# EAGLE design Mem Register V1.0 (EAGLE 9.6.2)

## Sheet 1 of 3: BUS
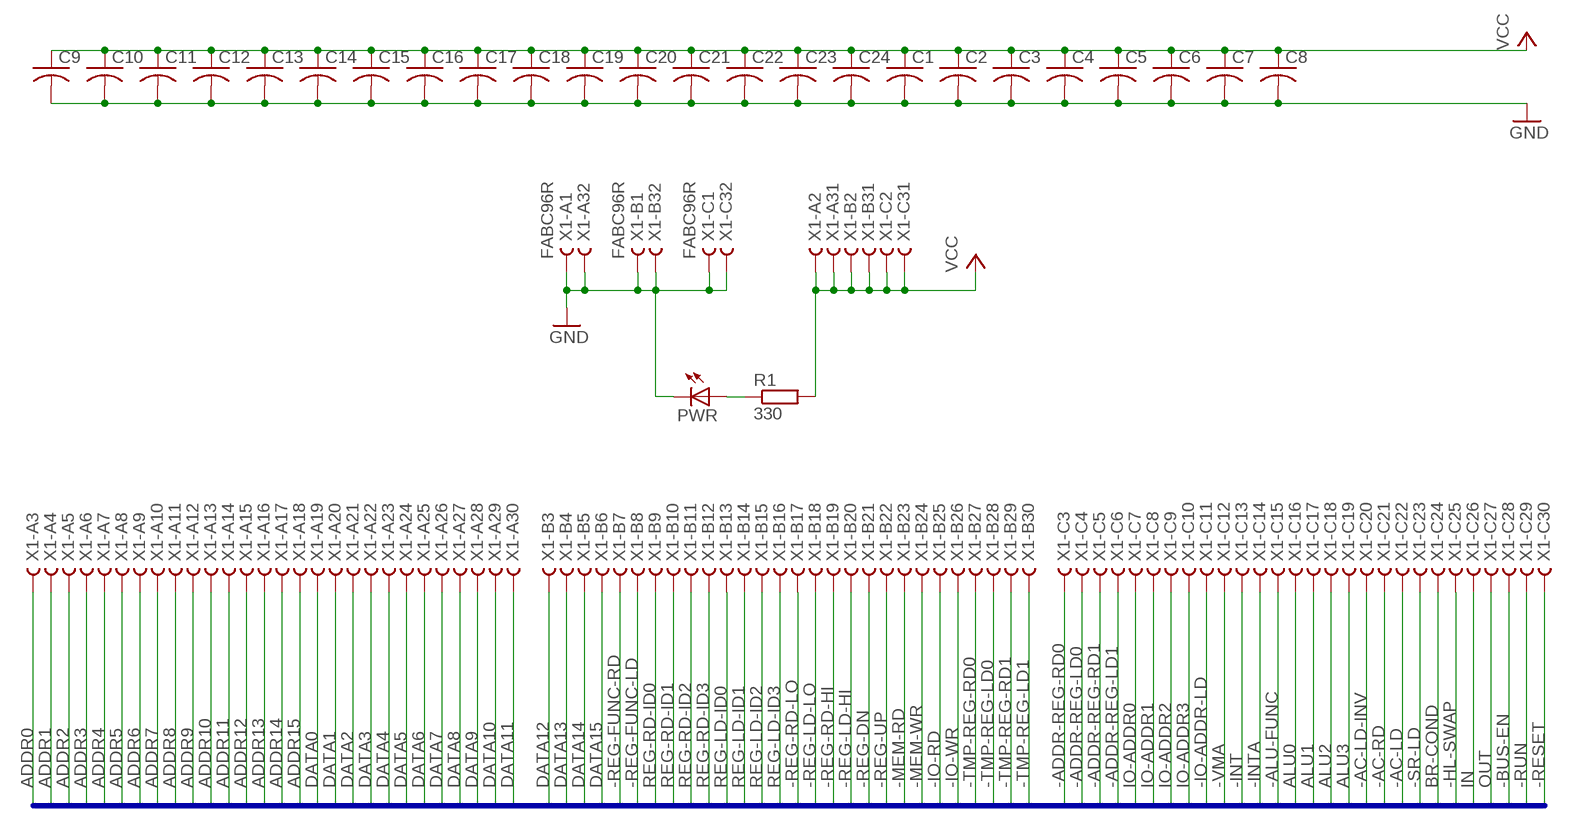
[diagram p0: schematic, sheet 1]

### Parts
C1  C-US025-025X050  [C025-025X050]
C2  C-US025-025X050  [C025-025X050]
C3  C-US025-025X050  [C025-025X050]
C4  C-US025-025X050  [C025-025X050]
C5  C-US025-025X050  [C025-025X050]
C6  C-US025-025X050  [C025-025X050]
C7  C-US025-025X050  [C025-025X050]
C8  C-US025-025X050  [C025-025X050]
C9  C-US025-025X050  [C025-025X050]
C10  C-US025-025X050  [C025-025X050]
C11  C-US025-025X050  [C025-025X050]
C12  C-US025-025X050  [C025-025X050]
C13  C-US025-025X050  [C025-025X050]
C14  C-US025-025X050  [C025-025X050]
C15  C-US025-025X050  [C025-025X050]
C16  C-US025-025X050  [C025-025X050]
C17  C-US025-025X050  [C025-025X050]
C18  C-US025-025X050  [C025-025X050]
C19  C-US025-025X050  [C025-025X050]
C20  C-US025-025X050  [C025-025X050]
C21  C-US025-025X050  [C025-025X050]
C22  C-US025-025X050  [C025-025X050]
C23  C-US025-025X050  [C025-025X050]
C24  C-US025-025X050  [C025-025X050]
PWR  LED5MM  [LED5MM]
R1  330  R0207/10  [0207/10]
X1  FABC96R  [FABC96R]

### Nets
-AC-LD: X1.C22
-AC-LD-INV: X1.C20
-AC-RD: X1.C21
-ADDR-REG-LD0: X1.C4
-ADDR-REG-LD1: X1.C6
-ADDR-REG-RD0: X1.C3
-ADDR-REG-RD1: X1.C5
-ALU-FUNC: X1.C15
-BUS-EN: X1.C28 ; also sheet 3
-HL-SWAP: X1.C25
-INT: X1.C13
-INTA: X1.C14
-IO-ADDR-LD: X1.C11
-IO-RD: X1.B25
-IO-WR: X1.B26
-MEM-RD: X1.B23 ; also sheet 3
-MEM-WR: X1.B24 ; also sheet 3
-REG-DN: X1.B21
-REG-FUNC-LD: X1.B8
-REG-FUNC-RD: X1.B7
-REG-LD-HI: X1.B20
-REG-LD-LO: X1.B18
-REG-RD-HI: X1.B19
-REG-RD-LO: X1.B17
-REG-UP: X1.B22
-RESET: X1.C30
-RUN: X1.C29
-SR-LD: X1.C23
-TMP-REG-LD0: X1.B28
-TMP-REG-LD1: X1.B30
-TMP-REG-RD0: X1.B27
-TMP-REG-RD1: X1.B29
-VMA: X1.C12 ; also sheet 3
ADDR0: X1.A3 ; also sheet 3
ADDR1: X1.A4 ; also sheet 3
ADDR2: X1.A5 ; also sheet 3
ADDR3: X1.A6 ; also sheet 3
ADDR4: X1.A7 ; also sheet 3
ADDR5: X1.A8 ; also sheet 3
ADDR6: X1.A9 ; also sheet 3
ADDR7: X1.A10 ; also sheet 3
ADDR8: X1.A11 ; also sheet 3
ADDR9: X1.A12 ; also sheet 3
ADDR10: X1.A13 ; also sheet 3
ADDR11: X1.A14 ; also sheet 3
ADDR12: X1.A15 ; also sheet 3
ADDR13: X1.A16 ; also sheet 3
ADDR14: X1.A17 ; also sheet 3
ADDR15: X1.A18 ; also sheet 3
ALU0: X1.C16
ALU1: X1.C17
ALU2: X1.C18
ALU3: X1.C19
BR-COND: X1.C24
DATA0: X1.A19 ; also sheet 2
DATA1: X1.A20 ; also sheet 2
DATA2: X1.A21 ; also sheet 2
DATA3: X1.A22 ; also sheet 2
DATA4: X1.A23 ; also sheet 2
DATA5: X1.A24 ; also sheet 2
DATA6: X1.A25 ; also sheet 2
DATA7: X1.A26 ; also sheet 2
DATA8: X1.A27
DATA9: X1.A28
DATA10: X1.A29
DATA11: X1.A30
DATA12: X1.B3
DATA13: X1.B4
DATA14: X1.B5
DATA15: X1.B6
GND: C1.2 C2.2 C3.2 C4.2 C5.2 C6.2 C7.2 C8.2 C9.2 C10.2 C11.2 C12.2 C13.2 C14.2 C15.2 C16.2 C17.2 C18.2 C19.2 C20.2 C21.2 C22.2 C23.2 C24.2 PWR.K(C) X1.A1 X1.A32 X1.B1 X1.B32 X1.C1 X1.C32 ; also sheet 3
IN: X1.C26
IO-ADDR0: X1.C7
IO-ADDR1: X1.C8
IO-ADDR2: X1.C9
IO-ADDR3: X1.C10
N$11: PWR.A R1.1
OUT: X1.C27
REG-LD-ID0: X1.B13
REG-LD-ID1: X1.B14
REG-LD-ID2: X1.B15
REG-LD-ID3: X1.B16
REG-RD-ID0: X1.B9
REG-RD-ID1: X1.B10
REG-RD-ID2: X1.B11
REG-RD-ID3: X1.B12
VCC: C1.1 C2.1 C3.1 C4.1 C5.1 C6.1 C7.1 C8.1 C9.1 C10.1 C11.1 C12.1 C13.1 C14.1 C15.1 C16.1 C17.1 C18.1 C19.1 C20.1 C21.1 C22.1 C23.1 C24.1 R1.2 X1.A2 X1.A31 X1.B2 X1.B31 X1.C2 X1.C31 ; also sheet 3

### Buses
-AC-LD,-AC-LD-INV,-AC-RD,ADDR[0..15],-ADDR-REG-LD[0..1],-ADDR-REG-RD[0..1],ALU[0..3],-ALU-FUNC,BR-COND,-BUS-EN,DATA[0..15],-HL-SWAP,IN,-INT,-INTA,IO-ADDR[0..3],-IO-ADDR-LD,-IO-RD,-IO-WR,-MEM-RD,-MEM-WR,OUT,-REG-DN,-REG-FUNC-LD,-REG-FUNC-RD,-REG-LD-HI,REG-LD-ID[0..3],-REG-LD-LO,-REG-RD-HI,REG-RD-ID[0..3],-REG-RD-LO,-REG-UP,-RESET,-RUN,-SR-LD,-TMP-REG-LD[0..1],-TMP-REG-RD[0..1],-VMA

## Sheet 2 of 3
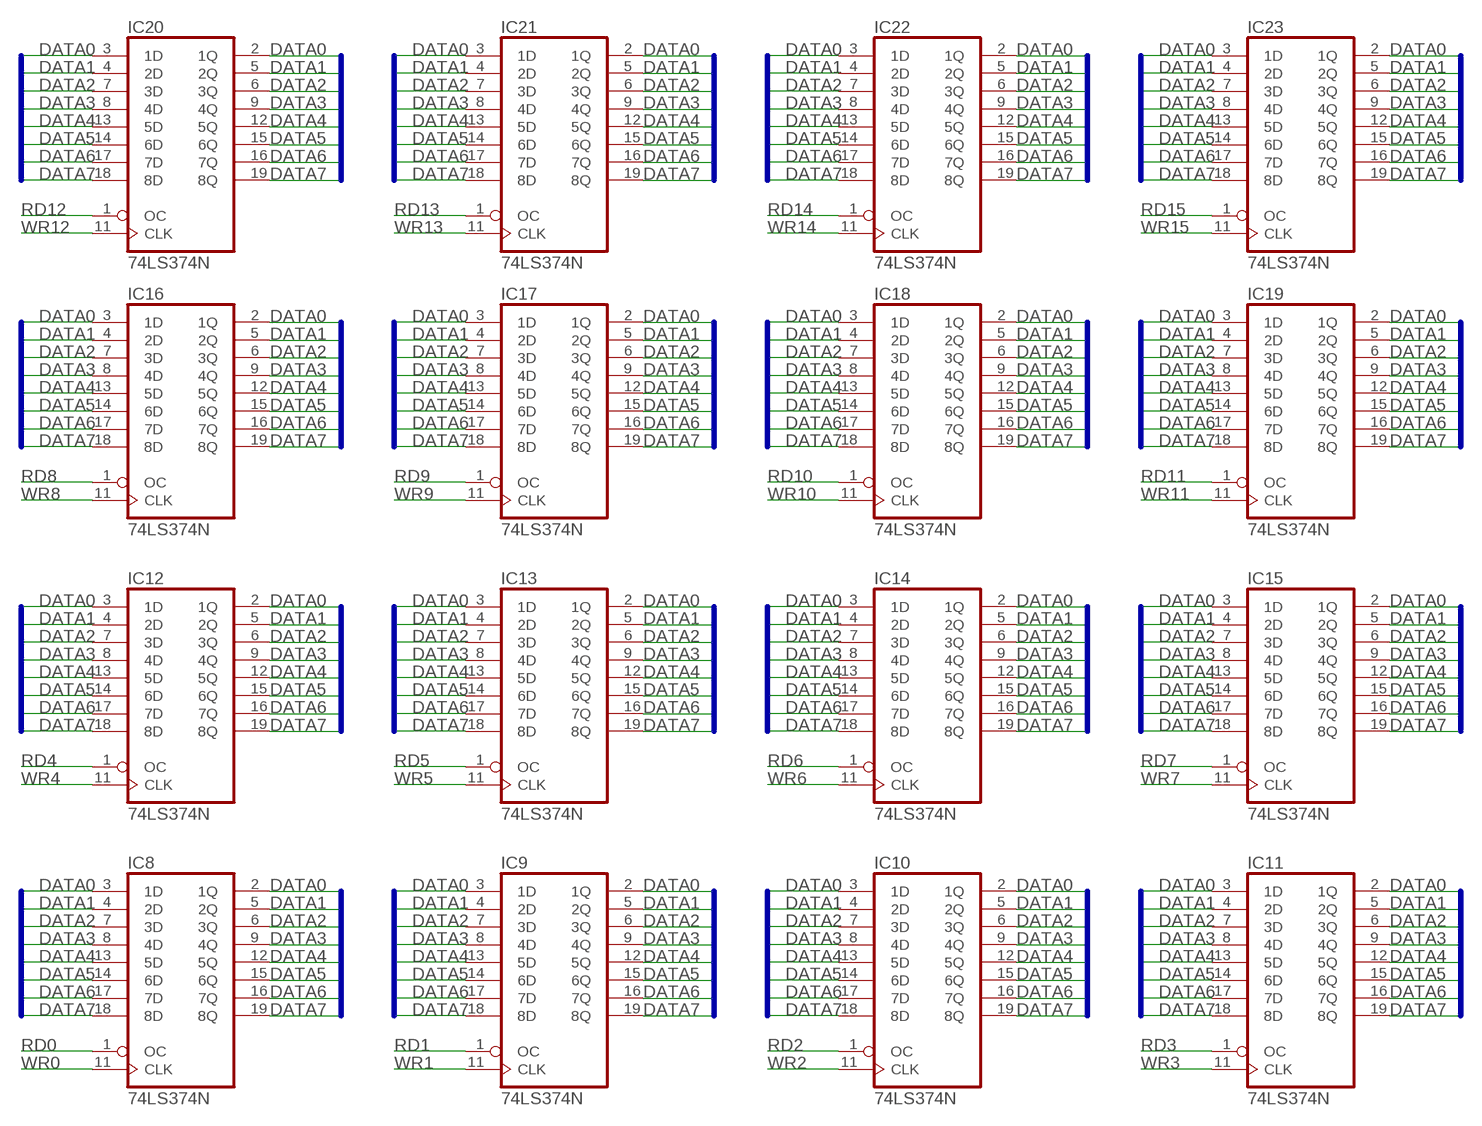
[diagram p1: schematic, sheet 2]

### Parts
IC8  74LS374N  [DIL20]
IC9  74LS374N  [DIL20]
IC10  74LS374N  [DIL20]
IC11  74LS374N  [DIL20]
IC12  74LS374N  [DIL20]
IC13  74LS374N  [DIL20]
IC14  74LS374N  [DIL20]
IC15  74LS374N  [DIL20]
IC16  74LS374N  [DIL20]
IC17  74LS374N  [DIL20]
IC18  74LS374N  [DIL20]
IC19  74LS374N  [DIL20]
IC20  74LS374N  [DIL20]
IC21  74LS374N  [DIL20]
IC22  74LS374N  [DIL20]
IC23  74LS374N  [DIL20]

### Nets
DATA0: IC8.2(1Q) IC8.3(1D) IC9.2(1Q) IC9.3(1D) IC10.2(1Q) IC10.3(1D) IC11.2(1Q) IC11.3(1D) IC12.2(1Q) IC12.3(1D) IC13.2(1Q) IC13.3(1D) IC14.2(1Q) IC14.3(1D) IC15.2(1Q) IC15.3(1D) IC16.2(1Q) IC16.3(1D) IC17.2(1Q) IC17.3(1D) IC18.2(1Q) IC18.3(1D) IC19.2(1Q) IC19.3(1D) IC20.2(1Q) IC20.3(1D) IC21.2(1Q) IC21.3(1D) IC22.2(1Q) IC22.3(1D) IC23.2(1Q) IC23.3(1D) ; also sheet 1
DATA1: IC8.4(2D) IC8.5(2Q) IC9.4(2D) IC9.5(2Q) IC10.4(2D) IC10.5(2Q) IC11.4(2D) IC11.5(2Q) IC12.4(2D) IC12.5(2Q) IC13.4(2D) IC13.5(2Q) IC14.4(2D) IC14.5(2Q) IC15.4(2D) IC15.5(2Q) IC16.4(2D) IC16.5(2Q) IC17.4(2D) IC17.5(2Q) IC18.4(2D) IC18.5(2Q) IC19.4(2D) IC19.5(2Q) IC20.4(2D) IC20.5(2Q) IC21.4(2D) IC21.5(2Q) IC22.4(2D) IC22.5(2Q) IC23.4(2D) IC23.5(2Q) ; also sheet 1
DATA2: IC8.6(3Q) IC8.7(3D) IC9.6(3Q) IC9.7(3D) IC10.6(3Q) IC10.7(3D) IC11.6(3Q) IC11.7(3D) IC12.6(3Q) IC12.7(3D) IC13.6(3Q) IC13.7(3D) IC14.6(3Q) IC14.7(3D) IC15.6(3Q) IC15.7(3D) IC16.6(3Q) IC16.7(3D) IC17.6(3Q) IC17.7(3D) IC18.6(3Q) IC18.7(3D) IC19.6(3Q) IC19.7(3D) IC20.6(3Q) IC20.7(3D) IC21.6(3Q) IC21.7(3D) IC22.6(3Q) IC22.7(3D) IC23.6(3Q) IC23.7(3D) ; also sheet 1
DATA3: IC8.8(4D) IC8.9(4Q) IC9.8(4D) IC9.9(4Q) IC10.8(4D) IC10.9(4Q) IC11.8(4D) IC11.9(4Q) IC12.8(4D) IC12.9(4Q) IC13.8(4D) IC13.9(4Q) IC14.8(4D) IC14.9(4Q) IC15.8(4D) IC15.9(4Q) IC16.8(4D) IC16.9(4Q) IC17.8(4D) IC17.9(4Q) IC18.8(4D) IC18.9(4Q) IC19.8(4D) IC19.9(4Q) IC20.8(4D) IC20.9(4Q) IC21.8(4D) IC21.9(4Q) IC22.8(4D) IC22.9(4Q) IC23.8(4D) IC23.9(4Q) ; also sheet 1
DATA4: IC8.12(5Q) IC8.13(5D) IC9.12(5Q) IC9.13(5D) IC10.12(5Q) IC10.13(5D) IC11.12(5Q) IC11.13(5D) IC12.12(5Q) IC12.13(5D) IC13.12(5Q) IC13.13(5D) IC14.12(5Q) IC14.13(5D) IC15.12(5Q) IC15.13(5D) IC16.12(5Q) IC16.13(5D) IC17.12(5Q) IC17.13(5D) IC18.12(5Q) IC18.13(5D) IC19.12(5Q) IC19.13(5D) IC20.12(5Q) IC20.13(5D) IC21.12(5Q) IC21.13(5D) IC22.12(5Q) IC22.13(5D) IC23.12(5Q) IC23.13(5D) ; also sheet 1
DATA5: IC8.14(6D) IC8.15(6Q) IC9.14(6D) IC9.15(6Q) IC10.14(6D) IC10.15(6Q) IC11.14(6D) IC11.15(6Q) IC12.14(6D) IC12.15(6Q) IC13.14(6D) IC13.15(6Q) IC14.14(6D) IC14.15(6Q) IC15.14(6D) IC15.15(6Q) IC16.14(6D) IC16.15(6Q) IC17.14(6D) IC17.15(6Q) IC18.14(6D) IC18.15(6Q) IC19.14(6D) IC19.15(6Q) IC20.14(6D) IC20.15(6Q) IC21.14(6D) IC21.15(6Q) IC22.14(6D) IC22.15(6Q) IC23.14(6D) IC23.15(6Q) ; also sheet 1
DATA6: IC8.16(7Q) IC8.17(7D) IC9.16(7Q) IC9.17(7D) IC10.16(7Q) IC10.17(7D) IC11.16(7Q) IC11.17(7D) IC12.16(7Q) IC12.17(7D) IC13.16(7Q) IC13.17(7D) IC14.16(7Q) IC14.17(7D) IC15.16(7Q) IC15.17(7D) IC16.16(7Q) IC16.17(7D) IC17.16(7Q) IC17.17(7D) IC18.16(7Q) IC18.17(7D) IC19.16(7Q) IC19.17(7D) IC20.16(7Q) IC20.17(7D) IC21.16(7Q) IC21.17(7D) IC22.16(7Q) IC22.17(7D) IC23.16(7Q) IC23.17(7D) ; also sheet 1
DATA7: IC8.18(8D) IC8.19(8Q) IC9.18(8D) IC9.19(8Q) IC10.18(8D) IC10.19(8Q) IC11.18(8D) IC11.19(8Q) IC12.18(8D) IC12.19(8Q) IC13.18(8D) IC13.19(8Q) IC14.18(8D) IC14.19(8Q) IC15.18(8D) IC15.19(8Q) IC16.18(8D) IC16.19(8Q) IC17.18(8D) IC17.19(8Q) IC18.18(8D) IC18.19(8Q) IC19.18(8D) IC19.19(8Q) IC20.18(8D) IC20.19(8Q) IC21.18(8D) IC21.19(8Q) IC22.18(8D) IC22.19(8Q) IC23.18(8D) IC23.19(8Q) ; also sheet 1
RD0: IC8.1(OC) ; also sheet 3
RD1: IC9.1(OC) ; also sheet 3
RD2: IC10.1(OC) ; also sheet 3
RD3: IC11.1(OC) ; also sheet 3
RD4: IC12.1(OC) ; also sheet 3
RD5: IC13.1(OC) ; also sheet 3
RD6: IC14.1(OC) ; also sheet 3
RD7: IC15.1(OC) ; also sheet 3
RD8: IC16.1(OC) ; also sheet 3
RD9: IC17.1(OC) ; also sheet 3
RD10: IC18.1(OC) ; also sheet 3
RD11: IC19.1(OC) ; also sheet 3
RD12: IC20.1(OC) ; also sheet 3
RD13: IC21.1(OC) ; also sheet 3
RD14: IC22.1(OC) ; also sheet 3
RD15: IC23.1(OC) ; also sheet 3
WR0: IC8.11(CLK) ; also sheet 3
WR1: IC9.11(CLK) ; also sheet 3
WR2: IC10.11(CLK) ; also sheet 3
WR3: IC11.11(CLK) ; also sheet 3
WR4: IC12.11(CLK) ; also sheet 3
WR5: IC13.11(CLK) ; also sheet 3
WR6: IC14.11(CLK) ; also sheet 3
WR7: IC15.11(CLK) ; also sheet 3
WR8: IC16.11(CLK) ; also sheet 3
WR9: IC17.11(CLK) ; also sheet 3
WR10: IC18.11(CLK) ; also sheet 3
WR11: IC19.11(CLK) ; also sheet 3
WR12: IC20.11(CLK) ; also sheet 3
WR13: IC21.11(CLK) ; also sheet 3
WR14: IC22.11(CLK) ; also sheet 3
WR15: IC23.11(CLK) ; also sheet 3

### Buses
DATA0,DATA1,DATA2,DATA3,DATA4,DATA5,DATA6,DATA7

## Sheet 3 of 3
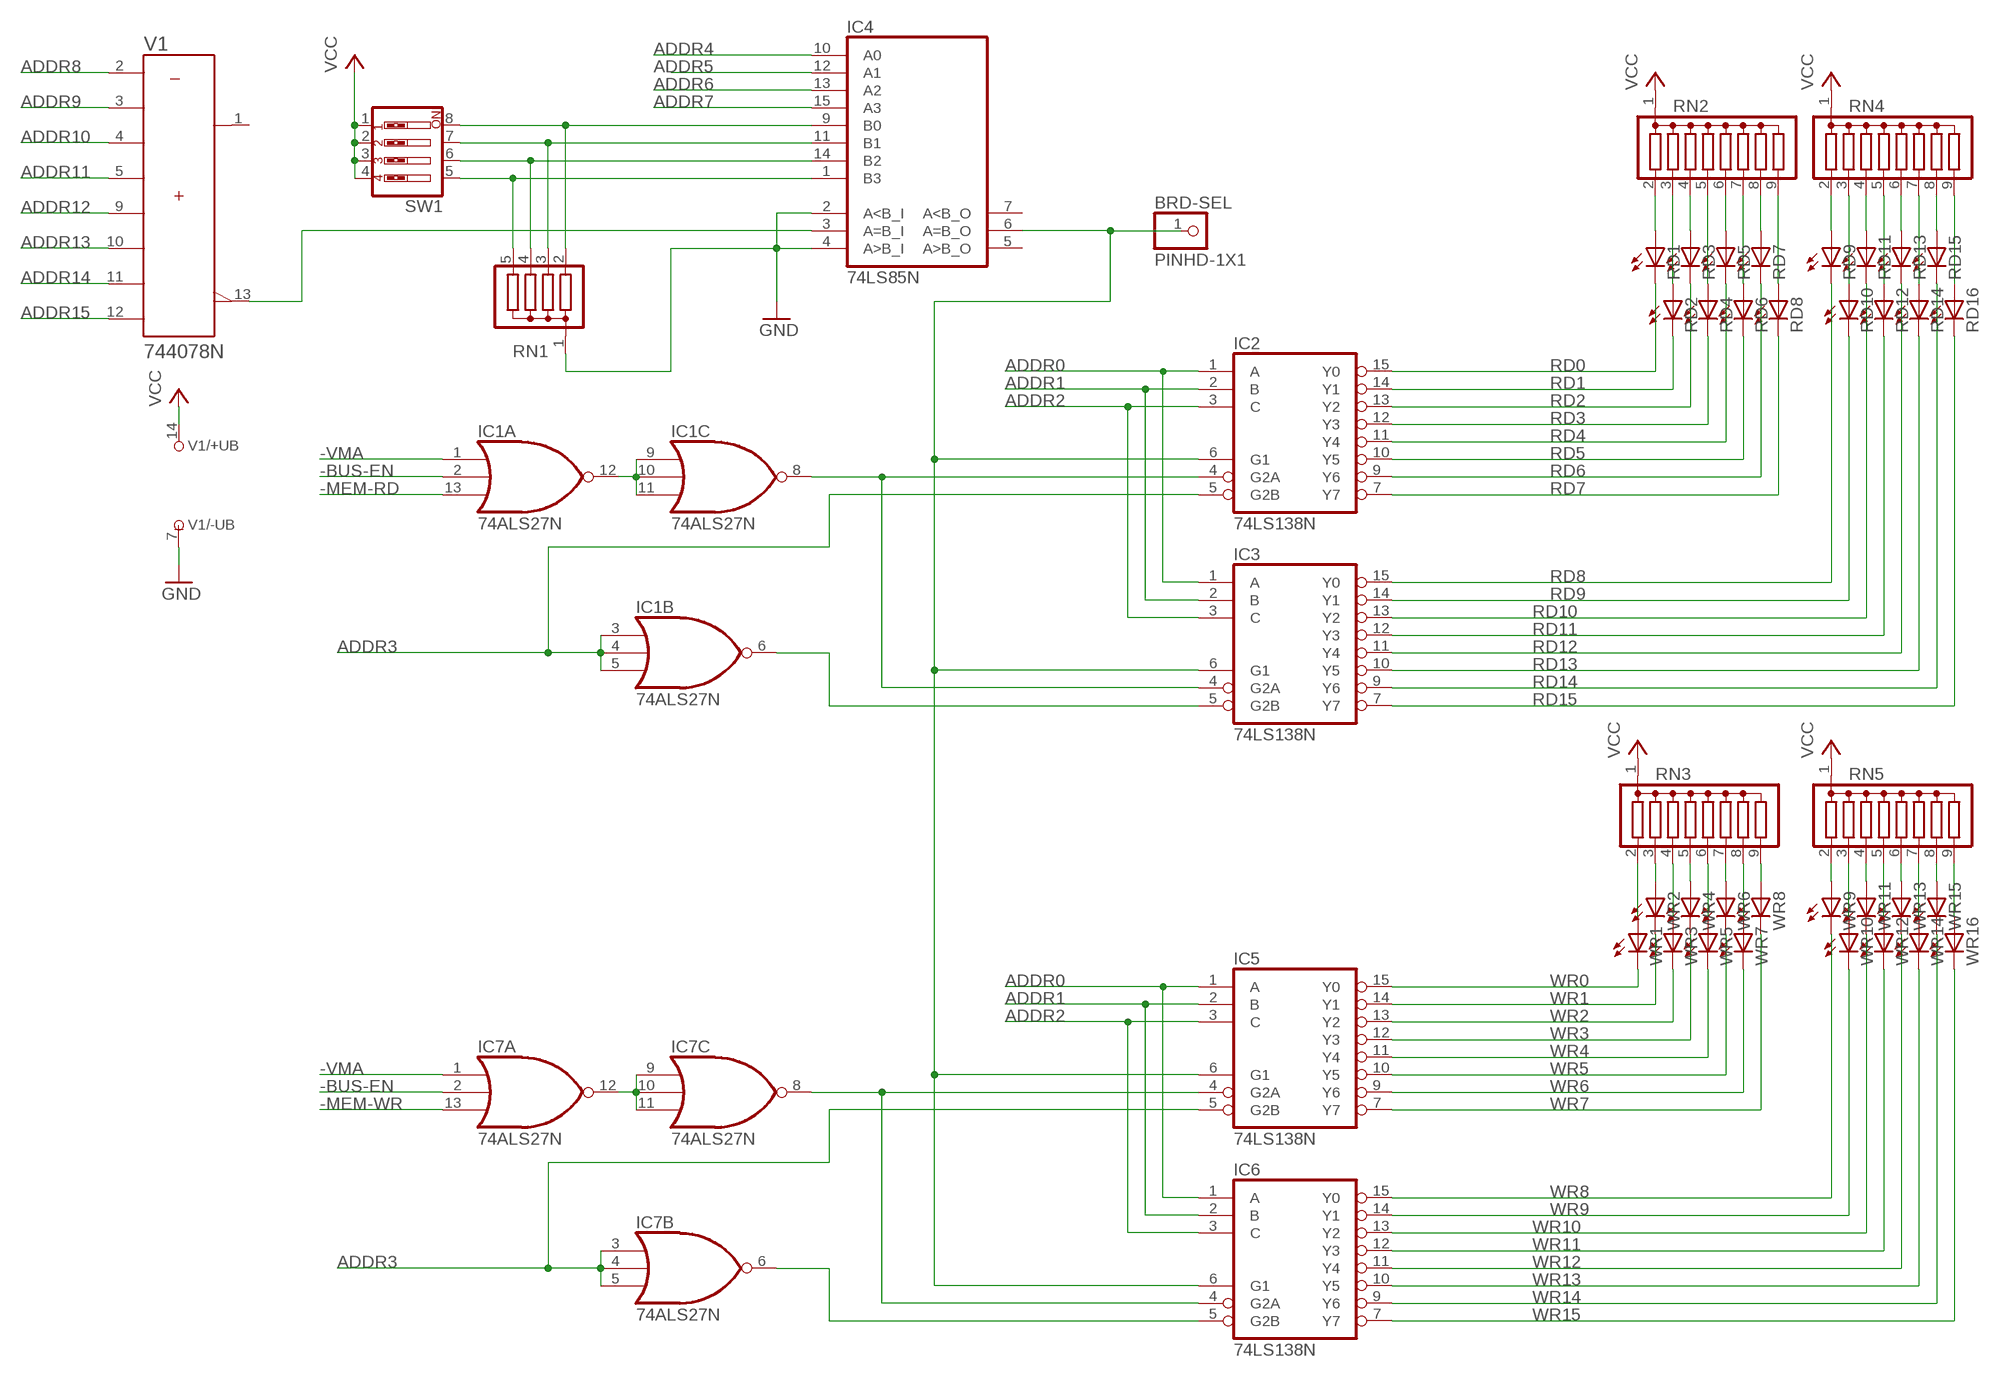
[diagram p2: schematic, sheet 3]

### Parts
BRD-SEL  PINHD-1X1  [1X01]
IC1  74ALS27N  [DIL14]
IC2  74LS138N  [DIL16]
IC3  74LS138N  [DIL16]
IC4  74LS85N  [DIL16]
IC5  74LS138N  [DIL16]
IC6  74LS138N  [DIL16]
IC7  74ALS27N  [DIL14]
RD1  LED3MM  [LED3MM]
RD2  LED3MM  [LED3MM]
RD3  LED3MM  [LED3MM]
RD4  LED3MM  [LED3MM]
RD5  LED3MM  [LED3MM]
RD6  LED3MM  [LED3MM]
RD7  LED3MM  [LED3MM]
RD8  LED3MM  [LED3MM]
RD9  LED3MM  [LED3MM]
RD10  LED3MM  [LED3MM]
RD11  LED3MM  [LED3MM]
RD12  LED3MM  [LED3MM]
RD13  LED3MM  [LED3MM]
RD14  LED3MM  [LED3MM]
RD15  LED3MM  [LED3MM]
RD16  LED3MM  [LED3MM]
RN1  G04R  [SIL5]
RN2  G08R  [SIL9]
RN3  G08R  [SIL9]
RN4  G08R  [SIL9]
RN5  G08R  [SIL9]
SW1  SW_DIP-4  [EDG-04]
V1  744078N  [DIL14]
WR1  LED3MM  [LED3MM]
WR2  LED3MM  [LED3MM]
WR3  LED3MM  [LED3MM]
WR4  LED3MM  [LED3MM]
WR5  LED3MM  [LED3MM]
WR6  LED3MM  [LED3MM]
WR7  LED3MM  [LED3MM]
WR8  LED3MM  [LED3MM]
WR9  LED3MM  [LED3MM]
WR10  LED3MM  [LED3MM]
WR11  LED3MM  [LED3MM]
WR12  LED3MM  [LED3MM]
WR13  LED3MM  [LED3MM]
WR14  LED3MM  [LED3MM]
WR15  LED3MM  [LED3MM]
WR16  LED3MM  [LED3MM]

### Nets
-BUS-EN: IC1.2(A:I1) IC7.2(A:I1) ; also sheet 1
-MEM-RD: IC1.13(A:I2) ; also sheet 1
-MEM-WR: IC7.13(A:I2) ; also sheet 1
-VMA: IC1.1(A:I0) IC7.1(A:I0) ; also sheet 1
ADDR0: IC2.1(A) IC3.1(A) IC5.1(A) IC6.1(A) ; also sheet 1
ADDR1: IC2.2(B) IC3.2(B) IC5.2(B) IC6.2(B) ; also sheet 1
ADDR2: IC2.3(C) IC3.3(C) IC5.3(C) IC6.3(C) ; also sheet 1
ADDR3: IC1.3(B:I0) IC1.4(B:I1) IC1.5(B:I2) IC2.5(G2B) IC5.5(G2B) IC7.3(B:I0) IC7.4(B:I1) IC7.5(B:I2) ; also sheet 1
ADDR4: IC4.10(A0) ; also sheet 1
ADDR5: IC4.12(A1) ; also sheet 1
ADDR6: IC4.13(A2) ; also sheet 1
ADDR7: IC4.15(A3) ; also sheet 1
ADDR8: V1.2(A) ; also sheet 1
ADDR9: V1.3(B) ; also sheet 1
ADDR10: V1.4(C) ; also sheet 1
ADDR11: V1.5(D) ; also sheet 1
ADDR12: V1.9(E) ; also sheet 1
ADDR13: V1.10(F) ; also sheet 1
ADDR14: V1.11(G) ; also sheet 1
ADDR15: V1.12(H) ; also sheet 1
GND: IC4.2(A<B_I) IC4.4(A>B_I) RN1.1 V1.7(-UB) ; also sheet 1
N$1: RD1.A RN2.2
N$2: IC7.9(C:I0) IC7.10(C:I1) IC7.11(C:I2) IC7.12(A:O)
N$3: IC6.5(G2B) IC7.6(B:O)
N$4: IC5.4(G2A) IC6.4(G2A) IC7.8(C:O)
N$5: RD3.A RN2.4
N$6: BRD-SEL.1 IC2.6(G1) IC3.6(G1) IC4.6(A=B_O) IC5.6(G1) IC6.6(G1)
N$7: RD2.A RN2.3
N$8: IC4.3(A=B_I) V1.13(W)
N$9: RD9.A RN4.2
N$10: RD4.A RN2.5
N$12: RD5.A RN2.6
N$13: RD7.A RN2.8
N$14: RD8.A RN2.9
N$15: RD6.A RN2.7
N$16: RD10.A RN4.3
N$17: RD11.A RN4.4
N$18: RD12.A RN4.5
N$19: IC1.9(C:I0) IC1.10(C:I1) IC1.11(C:I2) IC1.12(A:O)
N$20: RD13.A RN4.6
N$21: RD14.A RN4.7
N$22: RD15.A RN4.8
N$23: RD16.A RN4.9
N$24: RN3.2 WR1.A
N$25: RN3.3 WR2.A
N$26: RN3.4 WR3.A
N$27: RN3.5 WR4.A
N$28: IC4.9(B0) RN1.2 SW1.8
N$29: RN3.7 WR6.A
N$30: RN3.6 WR5.A
N$31: RN3.8 WR7.A
N$32: RN3.9 WR8.A
N$33: RN5.2 WR9.A
N$34: RN5.4 WR11.A
N$35: RN5.6 WR13.A
N$36: RN5.8 WR15.A
N$37: IC1.6(B:O) IC3.5(G2B)
N$38: RN5.9 WR16.A
N$39: RN5.7 WR14.A
N$40: RN5.5 WR12.A
N$41: RN5.3 WR10.A
N$46: IC4.11(B1) RN1.3 SW1.7
N$64: IC4.14(B2) RN1.4 SW1.6
N$73: IC4.1(B3) RN1.5 SW1.5
N$82: IC1.8(C:O) IC2.4(G2A) IC3.4(G2A)
RD0: IC2.15(Y0) RD1.K(C) ; also sheet 2
RD1: IC2.14(Y1) RD2.K(C) ; also sheet 2
RD2: IC2.13(Y2) RD3.K(C) ; also sheet 2
RD3: IC2.12(Y3) RD4.K(C) ; also sheet 2
RD4: IC2.11(Y4) RD5.K(C) ; also sheet 2
RD5: IC2.10(Y5) RD6.K(C) ; also sheet 2
RD6: IC2.9(Y6) RD7.K(C) ; also sheet 2
RD7: IC2.7(Y7) RD8.K(C) ; also sheet 2
RD8: IC3.15(Y0) RD9.K(C) ; also sheet 2
RD9: IC3.14(Y1) RD10.K(C) ; also sheet 2
RD10: IC3.13(Y2) RD11.K(C) ; also sheet 2
RD11: IC3.12(Y3) RD12.K(C) ; also sheet 2
RD12: IC3.11(Y4) RD13.K(C) ; also sheet 2
RD13: IC3.10(Y5) RD14.K(C) ; also sheet 2
RD14: IC3.9(Y6) RD15.K(C) ; also sheet 2
RD15: IC3.7(Y7) RD16.K(C) ; also sheet 2
VCC: RN2.1 RN3.1 RN4.1 RN5.1 SW1.1 SW1.2 SW1.3 SW1.4 V1.14(+UB) ; also sheet 1
WR0: IC5.15(Y0) WR1.K(C) ; also sheet 2
WR1: IC5.14(Y1) WR2.K(C) ; also sheet 2
WR2: IC5.13(Y2) WR3.K(C) ; also sheet 2
WR3: IC5.12(Y3) WR4.K(C) ; also sheet 2
WR4: IC5.11(Y4) WR5.K(C) ; also sheet 2
WR5: IC5.10(Y5) WR6.K(C) ; also sheet 2
WR6: IC5.9(Y6) WR7.K(C) ; also sheet 2
WR7: IC5.7(Y7) WR8.K(C) ; also sheet 2
WR8: IC6.15(Y0) WR9.K(C) ; also sheet 2
WR9: IC6.14(Y1) WR10.K(C) ; also sheet 2
WR10: IC6.13(Y2) WR11.K(C) ; also sheet 2
WR11: IC6.12(Y3) WR12.K(C) ; also sheet 2
WR12: IC6.11(Y4) WR13.K(C) ; also sheet 2
WR13: IC6.10(Y5) WR14.K(C) ; also sheet 2
WR14: IC6.9(Y6) WR15.K(C) ; also sheet 2
WR15: IC6.7(Y7) WR16.K(C) ; also sheet 2
Unconnected: IC4.5(A>B_O) IC4.7(A<B_O) V1.1(Y)

## Power pins joined to a net without a drawn wire
GND: IC1.7(P:GND) IC2.8(GND) IC3.8(GND) IC4.8(GND) IC5.8(GND) IC6.8(GND) IC7.7(P:GND) IC8.10(GND) IC9.10(GND) IC10.10(GND) IC11.10(GND) IC12.10(GND) IC13.10(GND) IC14.10(GND) IC15.10(GND) IC16.10(GND) IC17.10(GND) IC18.10(GND) IC19.10(GND) IC20.10(GND) IC21.10(GND) IC22.10(GND) IC23.10(GND)
VCC: IC1.14(P:VCC) IC2.16(VCC) IC3.16(VCC) IC4.16(VCC) IC5.16(VCC) IC6.16(VCC) IC7.14(P:VCC) IC8.20(VCC) IC9.20(VCC) IC10.20(VCC) IC11.20(VCC) IC12.20(VCC) IC13.20(VCC) IC14.20(VCC) IC15.20(VCC) IC16.20(VCC) IC17.20(VCC) IC18.20(VCC) IC19.20(VCC) IC20.20(VCC) IC21.20(VCC) IC22.20(VCC) IC23.20(VCC)

## Library data of the parts
BRD-SEL = Connector:PINHD-1X1: PIN HEADER; CATEGORY: CONNECTOR; SUB-CATEGORY: PIN-HEADER
C1-C24 = rcl:C-US: CAPACITOR, American symbol; SPICEPREFIX: C
IC1 IC7 = 74xx-us:74*27: Triple 3-input NOR gate
IC2 IC3 IC5 IC6 = 74xx-us:74*138: 3-line to 8-line DECODER/DEMULTIPLEXER
IC4 = 74xx-us:74*85: 4-bit magnitude COMPARATOR
IC8-IC23 = 74xx-us:74*374: Octal D type transparent LATCH, edge triggered
PWR = led:LED: LED
R1 = eagle-ltspice:R: RESISTOR, European symbol; SPICEMODEL: NONE; SPICEPREFIX: R
RD1-RD16 WR1-WR16 = adafruit:LED: LED
RN1 = resistor-sil:G04R: SIL RESISTOR; OC_FARNELL: unknown; OC_NEWARK: unknown
RN2-RN5 = resistor-sil:G08R: SIL RESISTOR; OC_FARNELL: unknown; OC_NEWARK: unknown
SW1 = special:SW_DIP-4: DIP SWITCH
V1 = 74ttl-din:74*4078: 8-input OR/NOR, complementary outputs
X1 = con-vg:FABC96R: CONNECTOR female, 96 pins, type R, rows ABC, grid 2.54 mm

## Net classes
1 GND: width 1 mm
2 5V: width 1 mm

## Board
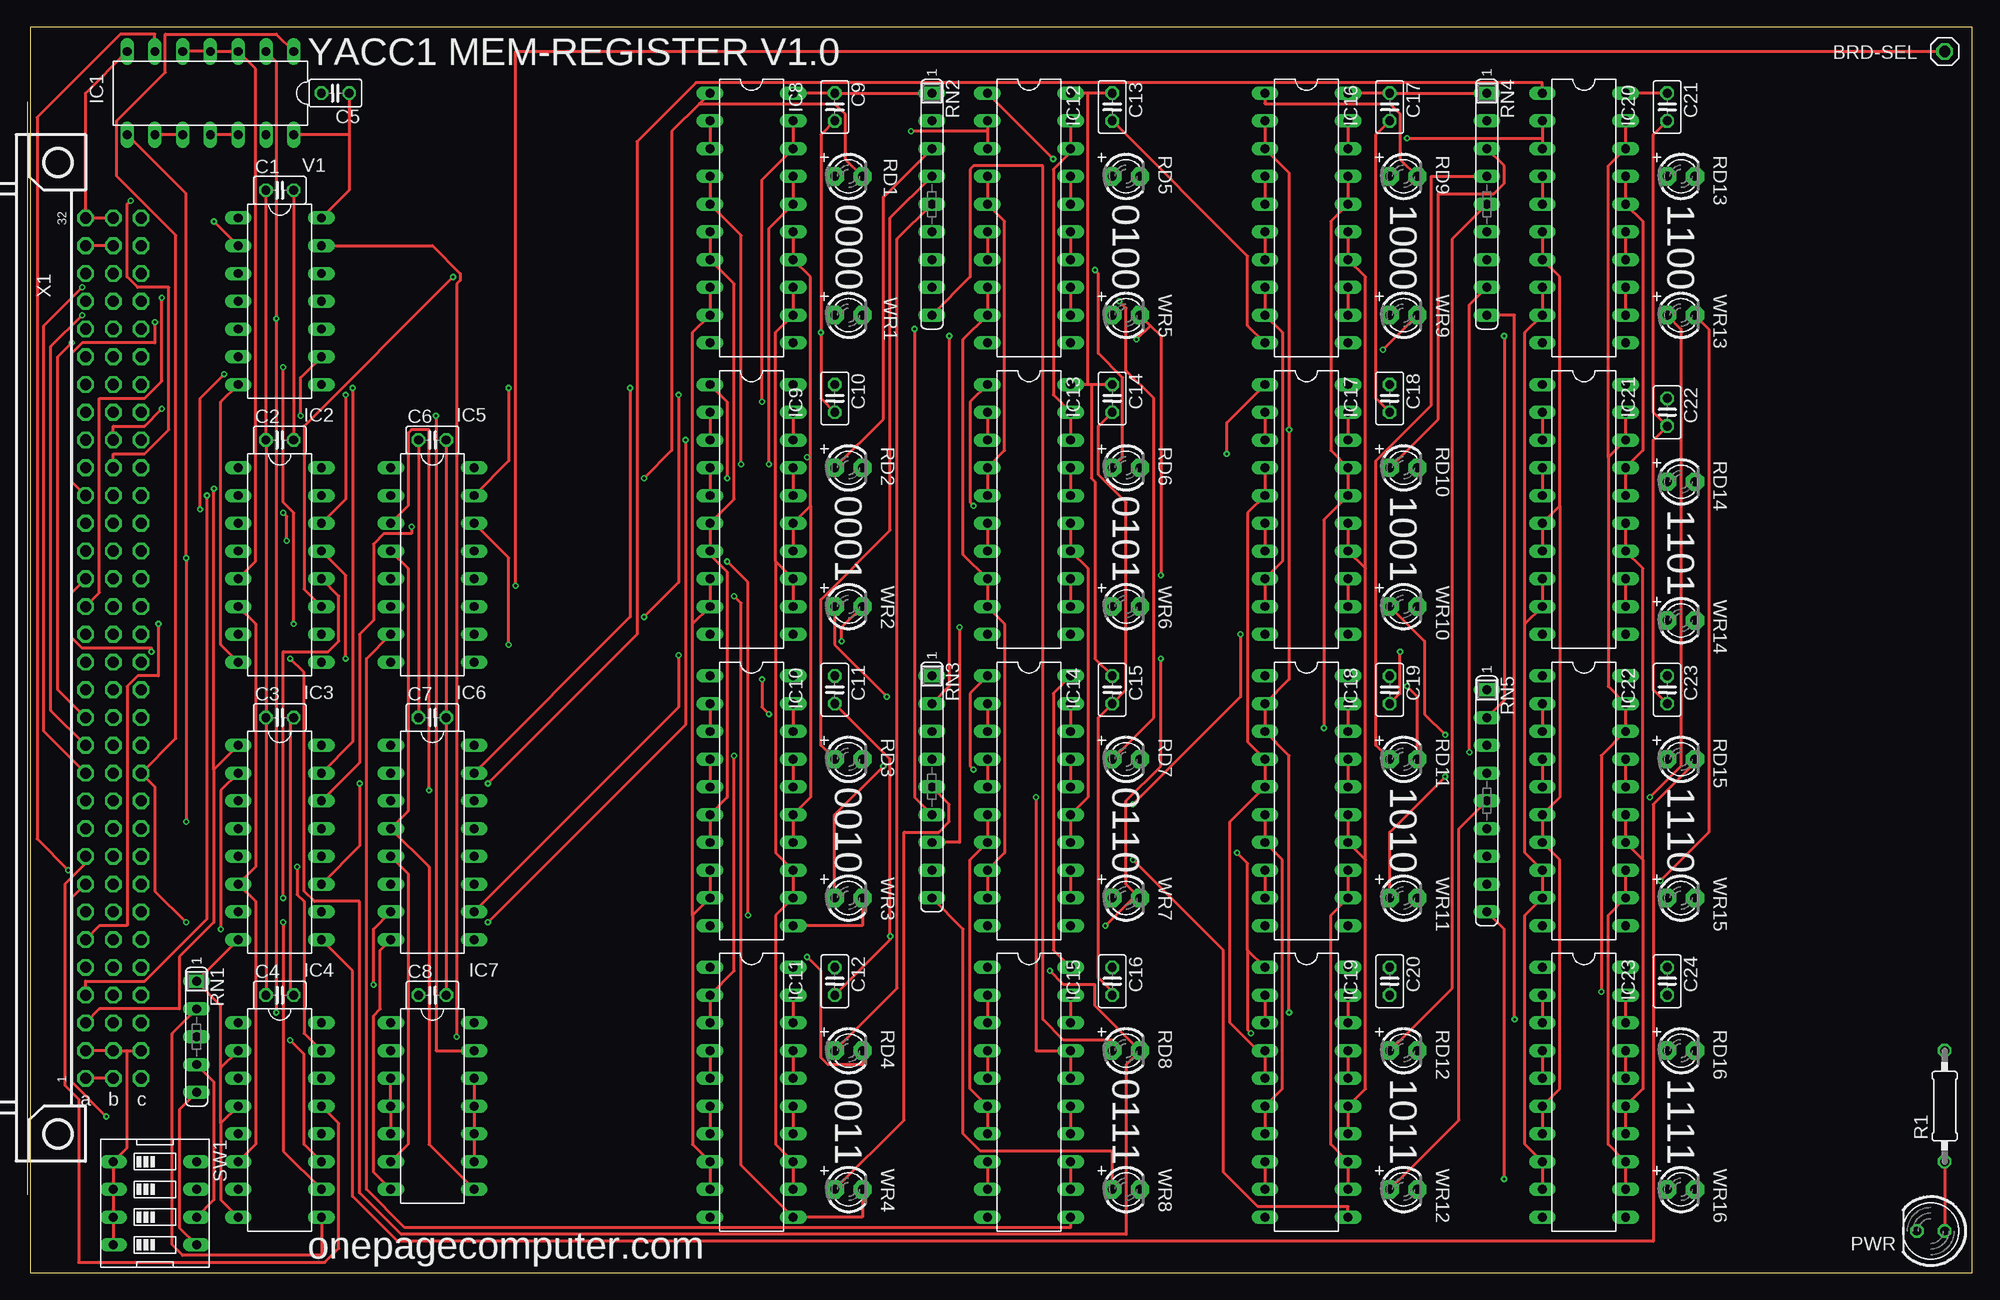
[diagram p3: board, top side]
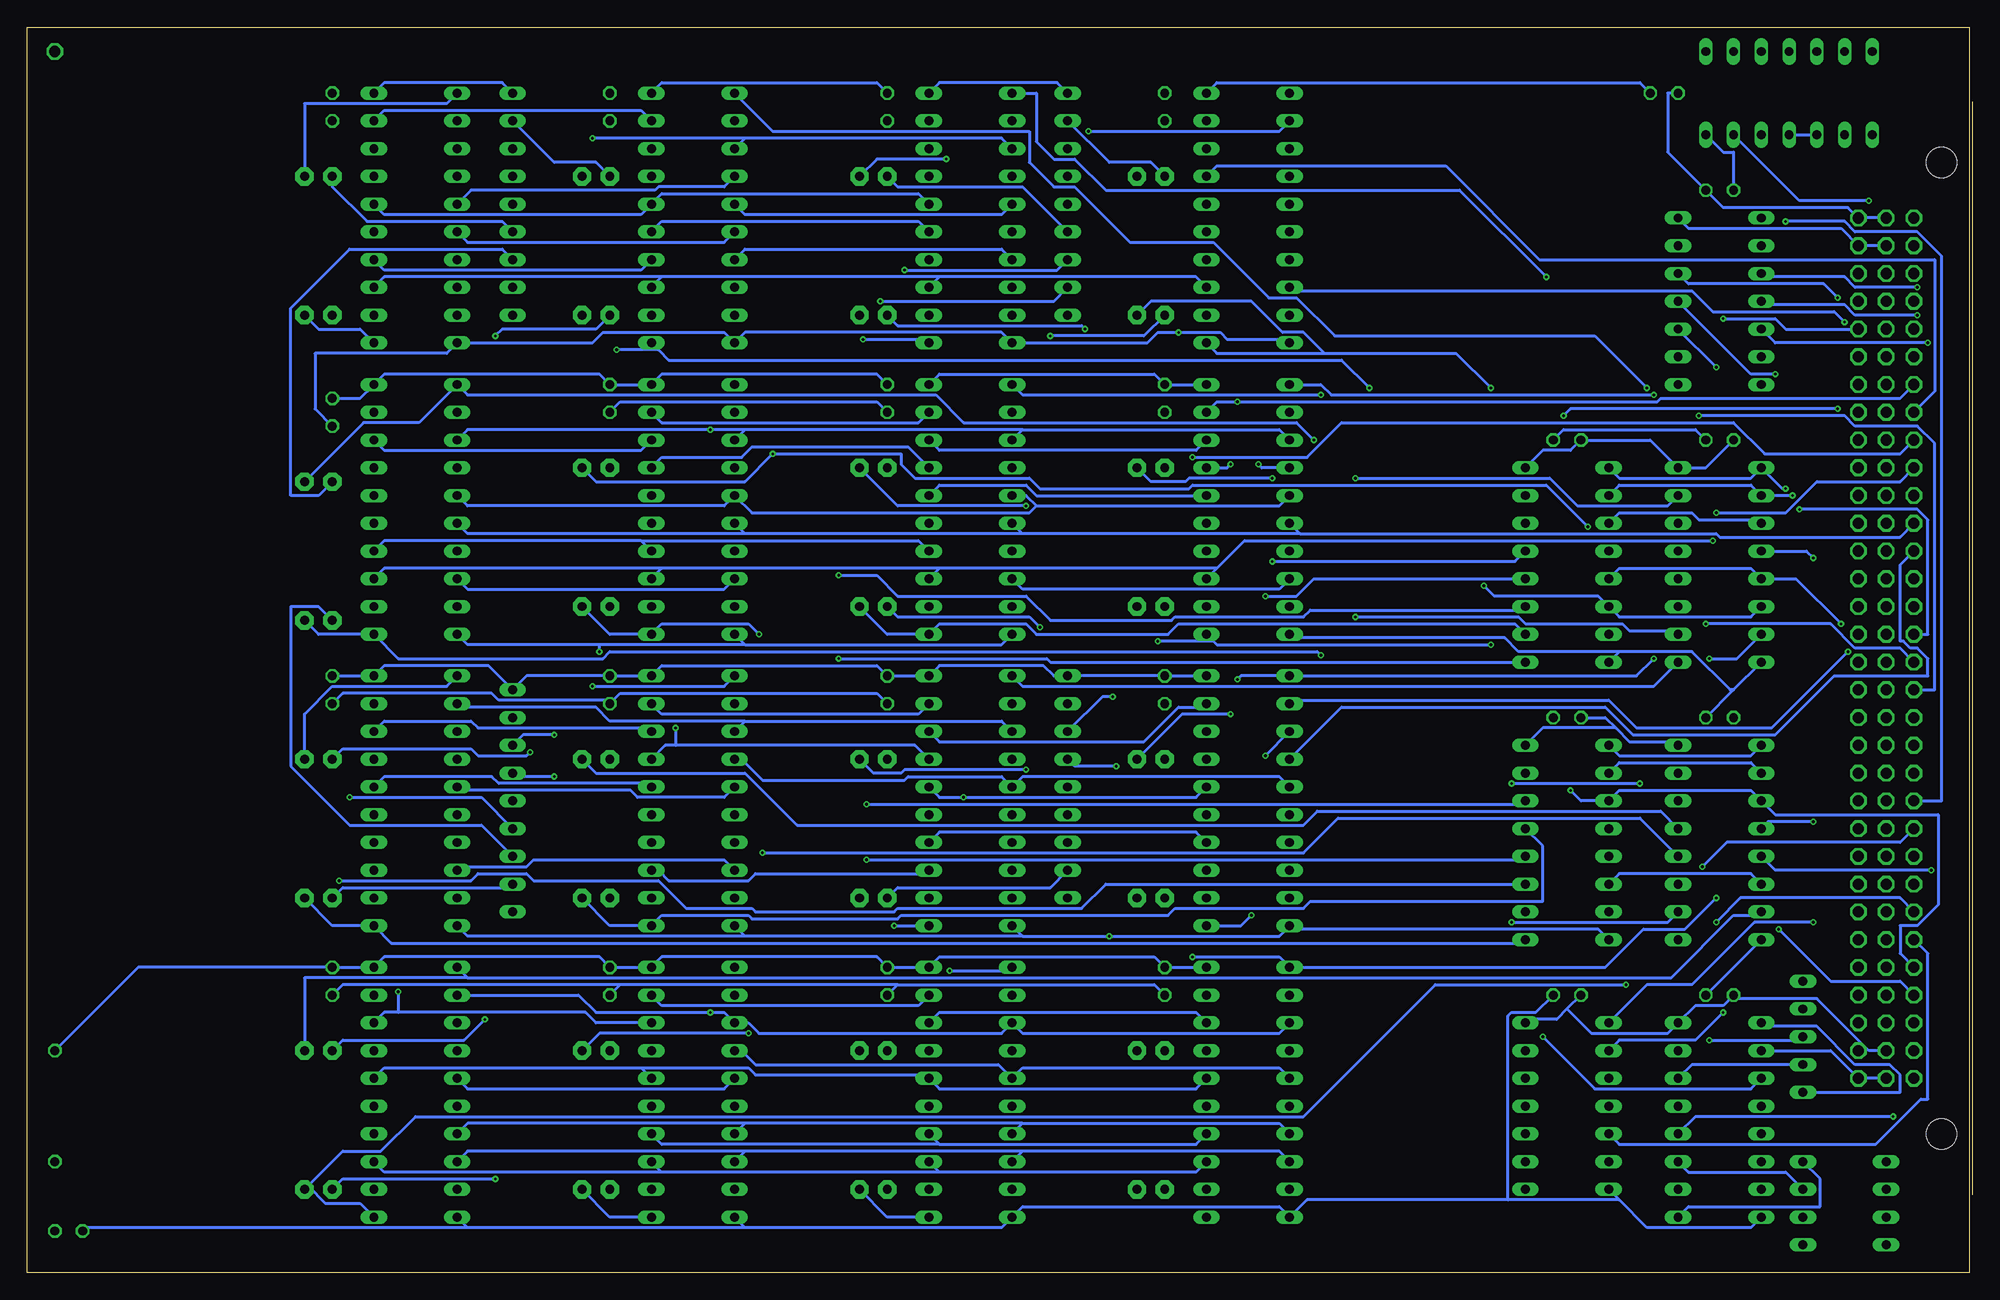
[diagram p4: board, bottom side, seen from below]

Size 177.78 x 113.97 mm. Coordinates in mm from the lower left corner, seen from the top.
Outline: 0,0 177.78,0 177.78,113.97 0,113.97 0,0
Copper layers (1*16): Top 0.035559375mm / dielectric 1.6mm / Bottom 0.035559375mm
Design rules "oshpark-2layer-auto-routing": minimum track width 10mil, minimum drill 10mil, track to track 10mil, track to pad 8mil, pad to pad 8mil, via to via 8mil, smd to smd 6mil, copper to edge 15mil, drill to drill 6mil, minimum pad ring 6mil, minimum via ring 6mil, stop-mask expansion 2.5mil, vias tented up to drill 0mil, thermal gap 10mil

### Footprints (pad centres in the part's own frame; a part is rotated, then mirrored left to right if it is on the bottom)
1X01 = drill 1.016 octagon: 1 0,0
C025-025X050 = drill 0.813 octagon: 1 -1.27,0; 2 1.27,0
DIL14 = drill 0.813 long: 1 -7.62,-3.81; 2 -5.08,-3.81; 3 -2.54,-3.81; 4 0,-3.81; 5 2.54,-3.81; 6 5.08,-3.81; 7 7.62,-3.81; 8 7.62,3.81; 9 5.08,3.81; 10 2.54,3.81; 11 0,3.81; 12 -2.54,3.81; 13 -5.08,3.81; 14 -7.62,3.81
DIL16 = drill 0.813 long: 1 -8.89,-3.81; 2 -6.35,-3.81; 3 -3.81,-3.81; 4 -1.27,-3.81; 5 1.27,-3.81; 6 3.81,-3.81; 7 6.35,-3.81; 8 8.89,-3.81; 9 8.89,3.81; 10 6.35,3.81; 11 3.81,3.81; 12 1.27,3.81; 13 -1.27,3.81; 14 -3.81,3.81; 15 -6.35,3.81; 16 -8.89,3.81
DIL20 = drill 0.813 long: 1 -11.43,-3.81; 2 -8.89,-3.81; 3 -6.35,-3.81; 4 -3.81,-3.81; 5 -1.27,-3.81; 6 1.27,-3.81; 7 3.81,-3.81; 8 6.35,-3.81; 9 8.89,-3.81; 10 11.43,-3.81; 11 11.43,3.81; 12 8.89,3.81; 13 6.35,3.81; 14 3.81,3.81; 15 1.27,3.81; 16 -1.27,3.81; 17 -3.81,3.81; 18 -6.35,3.81; 19 -8.89,3.81; 20 -11.43,3.81
LED5MM = drill 0.813 octagon: A -1.27,0; K 1.27,0
0207/10 = drill 0.813 octagon: 1 -5.08,0; 2 5.08,0
LED3MM = drill 0.813 pad 1.676 octagon: A -1.27,0; K 1.27,0
SIL5 = drill 0.813 long: 1 -5.08,0; 2 -2.54,0; 3 0,0; 4 2.54,0; 5 5.08,0
SIL9 = drill 0.813 long: 1 -10.16,0; 2 -7.62,0; 3 -5.08,0; 4 -2.54,0; 5 0,0; 6 2.54,0; 7 5.08,0; 8 7.62,0; 9 10.16,0
EDG-04 = drill 0.813 long: 1 -3.81,-3.81; 2 -1.27,-3.81; 3 1.27,-3.81; 4 3.81,-3.81; 5 3.81,3.81; 6 1.27,3.81; 7 -1.27,3.81; 8 -3.81,3.81
FABC96R = drill 1.016 octagon: A1 -2.54,39.37; A2 -2.54,36.83; A3 -2.54,34.29; A4 -2.54,31.75; A5 -2.54,29.21; A6 -2.54,26.67; A7 -2.54,24.13; A8 -2.54,21.59; A9 -2.54,19.05; A10 -2.54,16.51; A11 -2.54,13.97; A12 -2.54,11.43; A13 -2.54,8.89; A14 -2.54,6.35; A15 -2.54,3.81; A16 -2.54,1.27; A17 -2.54,-1.27; A18 -2.54,-3.81; A19 -2.54,-6.35; A20 -2.54,-8.89; A21 -2.54,-11.43; A22 -2.54,-13.97; A23 -2.54,-16.51; A24 -2.54,-19.05; A25 -2.54,-21.59; A26 -2.54,-24.13; A27 -2.54,-26.67; A28 -2.54,-29.21; A29 -2.54,-31.75; A30 -2.54,-34.29; A31 -2.54,-36.83; A32 -2.54,-39.37; B1 -5.08,39.37; B2 -5.08,36.83; B3 -5.08,34.29; B4 -5.08,31.75; B5 -5.08,29.21; B6 -5.08,26.67; B7 -5.08,24.13; B8 -5.08,21.59; B9 -5.08,19.05; B10 -5.08,16.51; B11 -5.08,13.97; B12 -5.08,11.43; B13 -5.08,8.89; B14 -5.08,6.35; B15 -5.08,3.81; B16 -5.08,1.27; B17 -5.08,-1.27; B18 -5.08,-3.81; B19 -5.08,-6.35; B20 -5.08,-8.89; B21 -5.08,-11.43; B22 -5.08,-13.97; B23 -5.08,-16.51; B24 -5.08,-19.05; B25 -5.08,-21.59; B26 -5.08,-24.13; B27 -5.08,-26.67; B28 -5.08,-29.21; B29 -5.08,-31.75; B30 -5.08,-34.29; B31 -5.08,-36.83; B32 -5.08,-39.37; C1 -7.62,39.37; C2 -7.62,36.83; C3 -7.62,34.29; C4 -7.62,31.75; C5 -7.62,29.21; C6 -7.62,26.67; C7 -7.62,24.13; C8 -7.62,21.59; C9 -7.62,19.05; C10 -7.62,16.51; C11 -7.62,13.97; C12 -7.62,11.43; C13 -7.62,8.89; C14 -7.62,6.35; C15 -7.62,3.81; C16 -7.62,1.27; C17 -7.62,-1.27; C18 -7.62,-3.81; C19 -7.62,-6.35; C20 -7.62,-8.89; C21 -7.62,-11.43; C22 -7.62,-13.97; C23 -7.62,-16.51; C24 -7.62,-19.05; C25 -7.62,-21.59; C26 -7.62,-24.13; C27 -7.62,-26.67; C28 -7.62,-29.21; C29 -7.62,-31.75; C30 -7.62,-34.29; C31 -7.62,-36.83; C32 -7.62,-39.37 | hole 2.794: 0,-44.456; 0,44.456

### Placement (x,y rotation side)
BRD-SEL  175.26,111.76 0 top
C1  22.86,99.06 0 top
C2  22.86,76.2 0 top
C3  22.86,50.8 0 top
C4  22.86,25.4 0 top
C5  27.94,107.95 180 top
C6  36.83,76.2 0 top
C7  36.83,50.8 0 top
C8  36.83,25.4 0 top
C9  73.66,106.68 270 top
C10  73.66,80.01 270 top
C11  73.66,53.34 270 top
C12  73.66,26.67 270 top
C13  99.06,106.68 270 top
C14  99.06,80.01 270 top
C15  99.06,53.34 270 top
C16  99.06,26.67 270 top
C17  124.46,106.68 270 top
C18  124.46,80.01 270 top
C19  124.46,53.34 270 top
C20  124.46,26.67 270 top
C21  149.86,106.68 270 top
C22  149.86,78.74 270 top
C23  149.86,53.34 270 top
C24  149.86,26.67 270 top
IC1  16.51,107.95 180 top
IC2  22.86,64.77 270 top
IC3  22.86,39.37 270 top
IC4  22.86,13.97 270 top
IC5  36.83,64.77 270 top
IC6  36.83,39.37 270 top
IC7  36.83,15.24 270 top
IC8  66.04,96.52 270 top
IC9  66.04,69.85 270 top
IC10  66.04,43.18 270 top
IC11  66.04,16.51 270 top
IC12  91.44,96.52 270 top
IC13  91.44,69.85 270 top
IC14  91.44,43.18 270 top
IC15  91.44,16.51 270 top
IC16  116.84,96.52 270 top
IC17  116.84,69.85 270 top
IC18  116.84,43.18 270 top
IC19  116.84,16.51 270 top
IC20  142.24,96.52 270 top
IC21  142.24,69.85 270 top
IC22  142.24,43.18 270 top
IC23  142.24,16.51 270 top
PWR  173.99,3.81 180 top
R1  175.26,15.24 90 top
RD1  74.93,100.33 0 top
RD2  74.93,73.66 0 top
RD3  74.93,46.99 0 top
RD4  74.93,20.32 0 top
RD5  100.33,100.33 0 top
RD6  100.33,73.66 0 top
RD7  100.33,46.99 0 top
RD8  100.33,20.32 0 top
RD9  125.73,100.33 0 top
RD10  125.73,73.66 0 top
RD11  125.73,46.99 0 top
RD12  125.73,20.32 0 top
RD13  151.13,100.33 0 top
RD14  151.13,72.39 0 top
RD15  151.13,46.99 0 top
RD16  151.13,20.32 0 top
RN1  15.24,21.59 270 top
RN2  82.55,97.79 270 top
RN3  82.55,44.45 270 top
RN4  133.35,97.79 270 top
RN5  133.35,43.18 270 top
SW1  11.43,6.35 270 top
V1  22.86,88.9 270 top
WR1  74.93,87.63 0 top
WR2  74.93,60.96 0 top
WR3  74.93,34.29 0 top
WR4  74.93,7.62 0 top
WR5  100.33,87.63 0 top
WR6  100.33,60.96 0 top
WR7  100.33,34.29 0 top
WR8  100.33,7.62 0 top
WR9  125.73,87.63 0 top
WR10  125.73,60.96 0 top
WR11  125.73,34.29 0 top
WR12  125.73,7.62 0 top
WR13  151.13,87.63 0 top
WR14  151.13,59.69 0 top
WR15  151.13,34.29 0 top
WR16  151.13,7.62 0 top
X1  2.54,57.15 180 top

### Tracks (layer width: path | path; a pad name or v marks a point on that pad's centre or on a via)
-BUS-EN  (via drill 0.25)
  Top 0.254: v22.54,23.81 v22.54,87.31 22.54,110.81 IC1.2
  Bottom 0.254: IC7.2 32.07,21.27 25.08,21.27 v22.54,23.81 | X1.C28 16.83,86.36 17.78,87.31 v22.54,87.31
-MEM-RD  (via drill 0.25)
  Top 0.254: v9.21,98.11 8.89,97.79 8.89,91.12 9.84,90.17 12.7,90.17 12.7,77.15 10.48,74.93 7.62,74.93 X1.B23
  Bottom 0.254: IC1.13 15.56,98.11 v9.21,98.11
-MEM-WR  (via drill 0.25)
  Top 0.254: IC7.13 37.15,20.32 v37.15,78.42 | v12.06,79.06 10.48,77.47 7.62,77.47 X1.B24
  Bottom 0.254: v37.15,78.42 36.51,79.06 v12.06,79.06
-VMA  (via drill 0.25)
  Top 0.254: v14.29,32.07 11.43,34.92 11.43,44.45 X1.C12 13.34,48.9 13.34,94.93 7.94,100.33 7.94,105.41 12.38,109.86 12.38,113.35 22.54,113.35 IC1.1
  Bottom 0.254: IC7.1 29.53,26.35 25.4,26.35 19.68,32.07 v14.29,32.07
ADDR0  (via drill 0.25)
  Top 0.254: X1.A3 6.35,24.13 13.65,24.13 13.65,28.89 16.83,32.07 16.83,46.04 | IC3.1 16.83,46.04 | 16.83,46.04 v16.83,71.75
  Bottom 0.254: IC5.1 32.07,72.71 20,72.71 IC2.1 17.14,71.75 v16.83,71.75 | IC3.1 20,47.31 32.07,47.31 IC6.1
ADDR1  (via drill 0.25)
  Top 0.254: v17.46,31.43 17.46,44.13 IC3.2 | v16.19,71.12 16.19,32.38 10.48,26.67 5.08,26.67 X1.A4
  Bottom 0.254: IC5.2 32.07,72.07 20,72.07 IC2.2 v16.19,71.12 | IC3.2 20,46.67 32.07,46.67 IC6.2 | X1.A4 6.35,26.67 12.7,26.67 v17.46,31.43
ADDR2  (via drill 0.25)
  Top 0.254: IC5.3 34.61,70.17 34.61,76.83 34.92,77.15 36.51,77.15 v36.51,44.13
  Bottom 0.254: IC2.3 19.37,68.9 24.77,68.9 25.4,69.53 32.07,69.53 IC5.3 | X1.A5 6.35,29.21 6.35,31.75 4.76,31.75 2.86,33.66 2.86,41.91 17.78,41.91 IC3.3 20,44.13 32.07,44.13 IC6.3 35.56,43.18 v36.51,44.13
ADDR3  (via drill 0.25)
  Top 0.254: IC7.5 IC7.4 IC7.3 | IC1.5 IC1.4 IC1.3 20.64,110.17 20.64,65.09 IC2.5 | X1.A6 6.35,31.75 8.89,31.75 8.89,53.66 9.84,54.61 11.75,54.61 v11.75,59.37
  Bottom 0.254: X1.A6 3.81,29.21 3.81,15.88 4.45,15.88 8.57,11.75 32.07,11.75 IC7.5 | IC5.5 32.07,64.45 20,64.45 IC2.5 15.88,63.5 v11.75,59.37
ADDR4  (via drill 0.25)
  Top 0.254: IC4.10 23.18,11.11 v23.18,32.07
  Bottom 0.254: v23.18,32.07 20.95,34.29 6.35,34.29 X1.A7
ADDR5  (via drill 0.25)
  Top 0.254: v6.99,14.29 3.81,17.46 3.81,34.29 X1.A8
  Bottom 0.254: IC4.12 25.08,14.29 v6.99,14.29
ADDR6
  Top 0.254: IC4.13 28.26,13.65 28.26,2.22 26.99,0.95 4.45,0.95 4.45,15.88 3.17,17.14 3.17,35.56 5.08,37.47 X1.A9
ADDR7  (via drill 0.25)
  Top 0.254: IC4.15 25.08,21.91 25.08,33.97 24.45,34.61 v24.45,37.15
  Bottom 0.254: v24.45,37.15 22.23,39.37 6.35,39.37 X1.A10
ADDR8  (via drill 0.25)
  Top 0.254: v16.83,96.2 V1.2
  Bottom 0.254: v16.83,96.2 11.43,96.2 10.48,95.25 4.76,95.25 2.54,93.03 2.54,43.18 X1.A11
ADDR9  (via drill 0.25)
  Top 0.254: v4.76,90.17 1.27,86.68 1.27,49.53 X1.A12
  Bottom 0.254: V1.3 18.73,91.12 11.43,91.12 10.48,90.17 v4.76,90.17
ADDR10  (via drill 0.25)
  Top 0.254: v4.76,87.63 1.91,84.77 1.91,51.44 X1.A13
  Bottom 0.254: V1.4 18.73,88.58 11.43,88.58 10.48,87.63 v4.76,87.63
ADDR11  (via drill 0.25)
  Top 0.254: v3.81,85.09 2.54,83.82 2.54,53.34 X1.A14
  Bottom 0.254: V1.5 17.78,85.09 v3.81,85.09
ADDR12  (via drill 0.25)
  Top 0.254: V1.9 24.77,81.92 v24.77,78.42
  Bottom 0.254: v24.77,78.42 11.43,78.42 10.48,77.47 4.76,77.47 3.17,75.88 3.17,53.34 X1.A15
ADDR13  (via drill 0.25)
  Top 0.254: v23.18,82.87 23.18,70.48 24.13,69.53 v24.13,59.37
  Bottom 0.254: v23.18,82.87 V1.10 | v24.13,59.37 12.7,59.37 10.48,57.15 6.35,57.15 X1.A16
ADDR14  (via drill 0.25)
  Top 0.254: v17.78,82.23 15.56,80.01 v15.56,69.85
  Bottom 0.254: V1.11 20,82.23 v17.78,82.23 | v15.56,69.85 4.76,69.85 3.81,68.9 3.81,58.42 X1.A17
ADDR15  (via drill 0.25)
  Top 0.254: v12.06,89.22 12.06,81.6 10.48,80.01 6.35,80.01 6.35,62.23 X1.A18
  Bottom 0.254: V1.12 25.72,90.49 13.34,90.49 v12.06,89.22
DATA0  (via drill 0.25)
  Top 0.254: IC21.2 IC21.3 | IC17.2 IC17.3 | IC9.2 IC9.3 | IC13.2 IC13.3 | IC22.2 IC22.3 | IC14.2 IC14.3 | IC20.2 138.43,103.82 | 138.43,103.82 IC20.3 | IC16.2 IC16.3 115.25,100.65 v115.25,77.15 115.25,54.29 IC18.2 IC18.3 115.25,47.31 v115.25,23.81 | IC8.2 IC8.3 | IC12.2 87.63,104.46 | 87.63,104.46 IC12.3 | 87.63,104.46 v80.64,104.46 | v126.05,103.82 138.43,103.82 | IC10.2 IC10.3 | X1.A19 3.81,62.23 3.81,58.1 4.76,57.15 11.11,57.15 v11.11,56.83 | IC11.3 IC11.2 64.45,27.62 v64.45,47.31 | IC15.2 IC15.3 | IC19.2 IC19.3 | IC23.2 IC23.3
  Bottom 0.254: IC9.3 63.18,77.15 86.68,77.15 | IC13.3 86.68,77.15 | 112.08,77.15 IC17.3 | 86.68,77.15 112.08,77.15 | IC21.3 137.48,77.15 v115.25,77.15 112.08,77.15 | IC14.3 88.58,50.48 112.08,50.48 | IC18.3 112.08,50.48 | IC22.2 138.11,51.75 125.73,51.75 124.46,50.48 112.08,50.48 | IC8.2 63.18,104.46 v80.64,104.46 | 112.08,103.82 IC16.3 | 112.08,103.82 88.58,103.82 IC12.3 | 112.08,103.82 v126.05,103.82 | v11.11,56.83 18.1,49.85 30.48,49.85 33.02,52.39 61.91,52.39 IC10.2 | IC11.3 63.18,21.91 86.68,21.91 IC15.3 88.58,21.91 110.81,21.91 111.76,22.86 IC19.3 113.98,23.81 v115.25,23.81 125.73,23.81 127.32,25.4 IC23.2 | v64.45,47.31 IC10.3
DATA1  (via drill 0.25)
  Top 0.254: IC20.4 IC20.5 | IC16.4 IC16.5 | IC12.4 IC12.5 89.22,96.2 89.22,75.25 IC13.4 IC13.5 | IC8.4 IC8.5 65.09,94.93 v65.09,73.98 | IC9.4 IC9.5 | IC14.4 IC14.5 | IC10.4 IC10.5 | IC21.4 IC21.5 | IC22.4 IC22.5 | IC17.4 IC17.5 111.44,69.53 111.44,48.58 IC18.4 IC18.5 109.86,41.27 109.86,22.86 113.03,19.68 | IC11.4 IC11.5 | IC15.4 IC15.5 | IC19.4 113.03,19.68 | 113.03,19.68 IC19.5 | IC23.4 IC23.5
  Bottom 0.254: IC9.5 63.18,70.17 85.41,70.17 | 85.41,70.17 86.36,71.12 IC13.5 | v65.09,73.98 64.77,73.66 IC9.4 | IC16.5 112.08,96.84 88.58,96.84 IC12.5 | IC20.5 137.16,99.06 120.33,99.06 120.02,99.38 113.98,99.38 IC16.4 | X1.A20 6.35,64.77 6.35,57.78 6.03,57.78 5.4,57.15 4.76,57.15 3.81,56.2 3.81,54.61 12.38,54.61 17.78,49.21 30.8,49.21 33.34,51.75 57.47,51.75 IC10.4 | IC10.5 63.18,45.4 86.68,45.4 IC14.5 88.58,45.4 97.16,45.4 97.47,45.09 110.49,45.09 112.39,46.99 IC18.4 | IC22.5 138.11,44.13 122.56,44.13 121.92,43.5 113.98,43.5 IC18.5 | IC21.5 137.48,70.17 113.98,70.17 IC17.5 111.44,69.53 86.04,69.53 85.41,70.17 | IC11.5 63.18,18.73 86.68,18.73 IC15.5 88.9,19.05 111.12,19.05 112.39,20.32 IC19.4 | IC19.5 113.98,16.83 137.48,16.83 IC23.5
DATA2
  Top 0.254: IC23.7 IC23.6 140.02,16.83 140.02,37.78 IC22.7 IC22.6 140.02,43.5 140.02,70.17 | IC18.6 IC18.7 114.62,37.78 114.62,16.83 IC19.6 IC19.7 | IC14.6 IC14.7 86.04,37.78 86.04,16.83 IC15.6 IC15.7 | IC11.6 IC11.7 | IC12.6 IC12.7 | IC16.6 IC16.7 | IC20.6 IC20.7 140.02,91.12 140.02,70.17 | IC21.7 IC21.6 140.02,70.17 | IC17.6 IC17.7 | IC8.6 IC8.7 64.45,90.49 64.45,70.8 IC9.6 IC9.7 62.23,65.72 63.82,64.14 63.82,43.5 IC10.6 IC10.7 | IC13.6 IC13.7
  Bottom 0.254: IC11.7 63.18,13.65 86.68,13.65 | IC15.7 86.68,13.65 | 112.08,13.65 IC19.7 | 86.68,13.65 112.08,13.65 | IC23.7 137.48,13.65 112.08,13.65 | IC12.7 88.58,93.66 112.08,93.66 IC16.7 | X1.A21 6.35,67.31 22.86,67.31 23.18,67.63 61.28,67.63 | IC9.6 61.28,67.63 | 86.68,67.63 IC13.6 | 61.28,67.63 86.68,67.63 | 112.08,67.63 IC17.6 | 86.68,67.63 112.08,67.63 | IC21.6 137.48,67.63 112.08,67.63 | IC16.6 113.98,94.3 137.48,94.3 IC20.6
DATA3  (via drill 0.25)
  Top 0.254: IC17.9 IC17.8 114.62,65.09 114.62,86.04 IC16.9 IC16.8 | IC20.8 IC20.9 136.84,86.04 136.84,59.37 | IC21.8 IC21.9 136.84,59.37 | IC18.8 IC18.9 | 136.84,59.37 136.84,38.42 IC22.8 IC22.9 136.84,32.7 136.84,11.75 IC23.8 IC23.9 | IC8.8 IC8.9 60.64,86.04 60.64,59.37 | X1.A22 3.81,72.39 3.81,84.14 4.76,85.09 11.43,85.09 v11.43,87 | IC12.8 IC12.9 85.41,85.41 85.41,65.72 IC13.8 IC13.9 89.22,59.37 89.22,38.42 IC14.8 IC14.9 | IC19.8 IC19.9 | IC15.8 IC15.9 | IC9.8 IC9.9 60.64,59.37 | IC11.9 IC11.8 60.64,11.75 60.64,32.7 | IC10.8 IC10.9 60.64,32.7 | 60.64,32.7 60.64,59.37
  Bottom 0.254: IC18.8 113.98,37.78 131.44,37.78 132.08,37.15 138.11,37.15 IC22.8 | IC17.8 113.98,62.55 137.48,62.55 IC21.8 | v11.43,87 12.38,87.95 23.5,87.95 25.4,89.85 61.91,89.85 IC8.8 | 86.68,11.11 IC15.8 | 86.68,11.11 63.18,11.11 IC11.8 | 112.08,11.11 IC19.8 | 86.68,11.11 112.08,11.11 | IC23.8 137.48,11.11 112.08,11.11 | IC13.8 86.68,62.55 63.18,62.55 IC9.8
DATA4  (via drill 0.25)
  Top 0.254: IC14.13 IC14.12 | IC18.13 IC18.12 119.06,32.7 119.06,11.75 IC19.13 IC19.12 | IC22.13 IC22.12 144.46,32.7 144.46,11.75 IC23.13 IC23.12 | IC15.13 IC15.12 | IC11.12 IC11.13 68.26,11.75 68.26,32.7 IC10.12 IC10.13 68.26,38.42 68.26,65.09 | IC20.13 IC20.12 | IC21.13 IC21.12 | IC16.13 IC16.12 | IC12.13 IC12.12 | IC17.13 IC17.12 | IC13.13 IC13.12 | IC8.13 IC8.12 68.26,86.04 68.26,65.09 | IC9.12 IC9.13 68.26,65.09 | v23.18,69.53 23.5,69.22 v23.5,66.99
  Bottom 0.254: IC14.13 95.57,36.51 111.12,36.51 111.76,35.88 119.06,35.88 120.02,36.83 IC18.13 | 94.3,9.21 IC15.13 | 94.3,9.21 70.8,9.21 IC11.13 | 119.7,9.21 IC19.13 | 94.3,9.21 119.7,9.21 | IC23.13 145.1,9.21 119.7,9.21 | X1.A23 6.35,72.39 13.97,72.39 16.83,69.53 v23.18,69.53 | v23.5,66.99 66.36,66.99 68.9,64.45 | IC9.13 68.9,64.45 | 94.3,64.45 IC13.13 | 68.9,64.45 94.3,64.45 | 119.7,64.45 IC17.13 | 94.3,64.45 119.7,64.45 | 94.3,91.12 IC12.13 | 94.3,91.12 70.8,91.12 IC8.13 | 119.7,91.12 IC16.13 | 94.3,91.12 119.7,91.12 | IC21.13 145.1,64.45 119.7,64.45 | IC20.13 145.1,91.12 119.7,91.12
DATA5  (via drill 0.25)
  Top 0.254: IC14.14 IC14.15 96.84,43.5 96.84,64.45 IC13.14 IC13.15 | IC8.15 IC8.14 71.44,91.12 71.44,74.3 | IC10.14 IC10.15 71.44,43.5 71.44,70.17 | IC9.14 IC9.15 71.44,70.17 | 71.44,74.3 v71.12,74.61 | 71.44,70.17 71.44,74.3 | IC21.15 IC21.14 147.64,64.45 147.64,37.78 | IC23.14 IC23.15 147.64,16.83 147.64,37.78 | IC22.15 IC22.14 147.64,37.78 | IC20.15 IC20.14 | IC12.15 IC12.14 | IC16.15 IC16.14 122.24,91.12 122.24,64.45 | IC17.15 IC17.14 122.24,64.45 | IC18.15 IC18.14 122.24,37.78 | IC19.14 IC19.15 122.24,16.83 122.24,37.78 | IC11.15 IC11.14 | IC15.15 IC15.14 | 122.24,37.78 122.24,64.45
  Bottom 0.254: X1.A24 6.35,74.93 18.73,74.93 21.59,77.79 57.47,77.79 60.64,74.61 v71.12,74.61 | IC14.14 94.3,40.32 70.8,40.32 IC10.14 | IC12.15 96.2,96.2 119.7,96.2 IC16.15 | IC20.14 145.1,91.76 121.6,91.76 IC16.14 | IC11.14 70.8,11.75 94.3,11.75 | IC15.14 94.3,11.75 | IC19.14 119.7,11.75 94.3,11.75 | IC21.14 145.1,66.99 121.6,66.99 | IC17.14 121.6,66.99 | IC13.14 96.2,66.99 121.6,66.99
DATA6  (via drill 0.25)
  Top 0.254: IC11.17 IC11.16 | IC15.16 IC15.17 92.08,20.32 v92.08,43.5 | IC19.17 IC19.16 | IC23.17 IC23.16 | IC22.17 IC22.16 | IC18.17 IC18.16 | IC10.17 IC10.16 | IC14.17 IC14.16 | IC8.17 IC8.16 67.63,95.57 v67.63,73.98 | IC21.16 IC21.17 147.64,75.25 147.64,96.2 IC20.16 IC20.17 | IC9.17 IC9.16 | IC13.17 IC13.16 | IC12.17 IC12.16 | IC16.17 IC16.16 119.06,96.2 119.06,75.25 IC17.17 IC17.16 118.43,68.9 v118.43,49.85
  Bottom 0.254: IC11.16 70.8,16.83 94.3,16.83 IC15.16 95.57,18.1 111.12,18.1 111.76,18.73 121.6,18.73 | 121.6,18.73 IC19.16 | 121.6,18.73 145.1,18.73 IC23.16 | IC10.16 70.8,43.5 v92.08,43.5 94.3,43.5 IC14.16 | IC18.17 119.38,48.26 118.43,48.26 | 118.43,48.26 96.52,48.26 IC14.17 | IC22.16 145.1,45.4 135.25,45.4 134.62,44.77 120.97,44.77 IC18.16 | X1.A25 3.17,80.64 3.17,92.71 39.37,92.71 47.94,101.28 68.9,101.28 IC8.17 | IC9.16 85.41,71.12 86.36,72.07 94.3,72.07 IC13.16 | IC12.16 96.2,98.74 119.7,98.74 IC16.16 121.6,96.84 145.1,96.84 IC20.16 | IC13.17 97.16,75.56 111.44,75.56 112.39,74.61 119.7,74.61 IC17.17 | v67.63,73.98 67.94,73.66 IC9.17 | v118.43,49.85 118.43,48.26
DATA7  (via drill 0.25)
  Top 0.254: IC13.18 IC13.19 93.66,80.33 93.66,100.97 95.25,102.55 IC12.18 IC12.19 | IC8.19 IC8.18 66.99,100.01 v66.99,79.69 | IC9.19 IC9.18 | IC23.19 IC23.18 | IC19.19 IC19.18 | IC11.19 IC11.18 | IC15.19 IC15.18 | IC18.19 IC18.18 | IC10.19 IC10.18 | IC14.19 IC14.18 | IC16.19 IC16.18 | IC20.19 IC20.18 144.46,101.28 144.46,74.61 | IC17.19 IC17.18 | IC21.19 IC21.18 144.46,74.61 | 144.46,74.61 144.46,53.66 IC22.19 IC22.18 143.83,47.31 v143.83,25.72
  Bottom 0.254: X1.A26 6.35,80.01 28.26,80.01 28.57,79.69 v66.99,79.69 68.9,79.69 IC9.19 | IC13.18 94.3,75.25 70.8,75.25 IC9.18 | IC11.18 70.8,23.81 94.3,23.81 IC15.18 | IC19.19 119.7,24.45 96.2,24.45 IC15.19 | IC23.18 145.1,23.81 143.83,23.81 | 143.83,23.81 126.68,23.81 125.73,22.86 IC19.18 | IC10.19 70.17,51.75 72.39,51.75 75.56,48.58 94.3,48.58 IC14.18 | IC18.19 119.7,51.12 96.2,51.12 IC14.19 | IC16.19 121.6,106.36 145.1,106.36 IC20.19 | IC17.18 121.6,75.25 145.1,75.25 IC21.18 | IC18.18 120.97,49.85 136.53,49.85 137.16,50.48 145.1,50.48 IC22.18 | v143.83,25.72 143.83,23.81 | IC13.19 96.2,77.79 119.7,77.79 IC17.19
GND  (via drill 0.25)
  Top 0.254: C10.2 72.39,80.01 v72.39,86.04 72.39,104.14 C9.2 | C13.2 111.44,93.03 111.44,86.68 IC16.10 | C17.2 123.19,104.14 123.19,80.01 C18.2 | C21.2 148.59,104.14 148.59,78.74 C22.2 148.59,76.2 148.59,53.34 C23.2 | v125.41,56.83 125.41,53.02 C19.2 | C14.2 97.79,77.47 97.79,73.03 100.33,70.48 100.33,53.34 C15.2 97.79,50.8 97.79,26.99 99.06,25.72 C16.2 | C8.2 C7.2 C6.2 | IC1.7 5.08,107.95 X1.A32 X1.B32 | C1.2 C2.2 | C11.2 78.74,46.99 v78.74,30.8 78.74,30.48 C12.2 | IC3.8 RN1.1 17.46,24.45 17.46,18.73 | X1.B1 X1.A1 | IC4.8 17.46,6.67 17.46,13.65 | IC4.4 17.46,13.65 | 17.46,18.73 IC4.2 | 17.46,13.65 17.46,18.73 | IC6.8 32.07,29.53 32.07,24.13 31.43,23.5 31.43,9.21 IC7.7 | V1.7 17.46,79.69 17.46,57.47 IC2.8 | C4.2 23.81,25.72 23.81,50.48 C3.2
  Bottom 0.254: IC8.10 62.55,85.41 67.94,85.41 68.58,86.04 v72.39,86.04 74.3,86.04 75.25,85.09 IC12.10 88.58,86.04 112.08,86.04 IC16.10 113.98,86.04 125.09,86.04 126.05,85.09 IC20.10 139.38,84.14 151.45,84.14 151.45,79.06 C22.2 | C14.2 100.01,79.69 123.51,79.69 C18.2 | IC13.10 88.58,57.47 112.08,57.47 | IC17.10 112.08,57.47 | IC21.10 137.48,57.47 125.41,57.47 | 112.08,57.47 125.41,57.47 | C15.2 100.01,53.02 123.51,53.02 124.14,52.39 | C23.2 148.91,53.02 135.25,53.02 134.62,52.39 124.14,52.39 | 124.14,52.39 C19.2 | v125.41,56.83 125.41,57.47 | C2.2 25.08,77.15 37.15,77.15 C6.2 | C5.2 27.62,107.95 27.62,102.55 C1.2 22.54,97.47 11.11,97.47 X1.C32 X1.B32 | 112.08,4.13 IC19.10 | 112.08,4.13 88.58,4.13 IC15.10 86.68,6.03 63.18,6.03 IC11.10 60.64,6.67 42.23,6.67 | 137.48,4.13 IC23.10 | 112.08,4.13 137.48,4.13 | PWR.K 172.4,4.13 137.48,4.13 | C12.2 74.61,26.35 98.11,26.35 | C16.2 98.11,26.35 | 123.51,26.35 C20.2 | 98.11,26.35 123.51,26.35 | C24.2 148.91,26.35 123.51,26.35 | 86.68,30.8 v78.74,30.8 63.18,30.8 IC10.10 61.91,31.43 33.97,31.43 IC6.8 | IC14.10 86.68,30.8 | 112.08,30.8 IC18.10 | 86.68,30.8 112.08,30.8 | IC22.10 137.48,30.8 112.08,30.8 | IC3.8 C4.2 | X1.B1 X1.C1 12.7,20.32 IC4.2 | 32.07,6.67 29.53,4.13 20,4.13 IC4.8 | 32.07,6.67 IC7.7 | C3.2 21.59,53.34 | 21.59,53.34 IC2.8 | 32.07,56.83 IC5.8 | 32.07,56.83 25.4,56.83 21.91,53.34 21.59,53.34 | IC9.10 61.91,58.1 42.55,58.1 41.27,56.83 32.07,56.83 | 32.07,6.67 42.23,6.67 | C8.2 39.69,23.81 41.91,23.81 42.23,23.5 42.23,6.67
N$1
  Bottom 0.254: RN2.2 78.74,101.6 74.93,101.6 RD1.A
N$2
  Top 0.254: IC7.9 IC7.10 IC7.11 IC7.12
N$3
  Top 0.254: IC7.6 34.61,11.75 34.61,36.51 IC6.5
N$4
  Top 0.254: IC5.4 34.61,64.45 34.61,42.23 IC6.4 36.51,37.15 36.51,11.75 IC7.8
N$5
  Top 0.254: RN2.4 78.74,96.52 78.74,67.94 72.39,61.59 72.39,48.26 RD3.A
N$6  (via drill 0.25)
  Top 0.254: IC4.6 20.64,11.75 20.64,33.97 IC3.6 20.64,37.15 20.64,59.37 IC2.6 | BRD-SEL.1 44.45,111.76 v44.45,62.87
  Bottom 0.254: IC6.6 32.07,36.51 20,36.51 IC3.6 | IC2.6 20,60.01 32.07,60.01 IC5.6 33.97,61.91 43.5,61.91 v44.45,62.87
N$7
  Top 0.254: RN2.3 78.11,98.42 78.11,78.11 RD2.A
N$8  (via drill 0.25)
  Top 0.254: v39.05,21.59 39.05,90.49 39.37,90.81 39.37,91.44 36.83,93.98 V1.13
  Bottom 0.254: IC4.3 20,16.83 34.29,16.83 v39.05,21.59
N$9
  Bottom 0.254: RN4.2 129.54,101.6 125.73,101.6 RD9.A
N$10
  Top 0.254: RN2.5 79.38,94.61 79.38,26.04 RD4.A
N$11
  Top 0.254: R1.1 PWR.A
N$12
  Bottom 0.254: RN2.6 86.68,99.38 98.11,99.38 RD5.A
N$13  (via drill 0.25)
  Top 0.254: v99.69,88.9 100.33,88.27 100.33,82.55 102.87,80.01 102.87,50.8 RD7.A
  Bottom 0.254: RN2.8 83.82,88.9 v99.69,88.9
N$14
  Top 0.254: RN2.9 86.04,91.12 86.04,100.97 86.36,101.28 92.71,101.28 92.71,23.18 94.61,21.27 99.06,21.27 RD8.A
N$15  (via drill 0.25)
  Top 0.254: v97.47,91.76 97.79,91.44 97.79,84.14 100.01,81.92 100.01,74.61 RD6.A
  Bottom 0.254: RN2.7 83.5,91.76 v97.47,91.76
N$16
  Top 0.254: RN4.3 134.94,101.28 134.94,99.69 133.99,98.74 128.91,98.74 128.91,78.11 RD10.A
N$17
  Top 0.254: RN4.4 128.27,100.33 128.27,79.38 123.19,74.3 123.19,48.26 RD11.A
N$18
  Top 0.254: RN4.5 130.18,94.61 130.18,26.04 RD12.A
N$19
  Top 0.254: IC1.10 IC1.9 | IC1.12 IC1.11
  Bottom 0.254: IC1.11 IC1.10
N$20
  Bottom 0.254: RN4.6 134.3,96.2 146.69,96.2 149.86,99.38 RD13.A
N$21
  Bottom 0.254: RN4.7 134.3,93.66 148.27,93.66 153.67,88.27 153.67,71.12 151.13,71.12 RD14.A
N$22  (via drill 0.25)
  Top 0.254: RN4.8 131.76,88.58 v131.76,47.62
  Bottom 0.254: v131.76,47.62 132.08,47.31 136.53,47.31 137.16,47.94 148.91,47.94 RD15.A
N$23  (via drill 0.25)
  Top 0.254: RN4.9 135.89,87.63 v135.89,23.18
  Bottom 0.254: v135.89,23.18 137.79,21.27 148.91,21.27 RD16.A
N$24  (via drill 0.25)
  Top 0.254: RN3.2 84.14,53.66 v84.14,85.72
  Bottom 0.254: v84.14,85.72 75.56,85.72 WR1.A
N$25  (via drill 0.25)
  Top 0.254: v78.42,52.7 73.66,57.47 WR2.A
  Bottom 0.254: RN3.3 79.38,52.7 v78.42,52.7
N$26  (via drill 0.25)
  Top 0.254: v78.11,46.35 73.66,41.91 WR3.A
  Bottom 0.254: RN3.4 81.92,46.35 v78.11,46.35
N$27
  Top 0.254: RN3.5 84.14,42.86 84.14,41.27 83.19,40.32 80.01,40.32 80.01,13.97 WR4.A
N$28
  Top 0.254: RN1.2 13.02,21.91 13.02,2.54 13.97,1.59 26.67,1.59 IC4.9
  Bottom 0.254: SW1.8 13.65,8.57 13.65,6.03 25.72,6.03 IC4.9
N$29  (via drill 0.25)
  Top 0.254: RN3.7 85.09,39.37 v85.09,59.05
  Bottom 0.254: v85.09,59.05 86.04,60.01 98.11,60.01 WR6.A
N$30  (via drill 0.25)
  Top 0.254: RN3.6 80.96,43.5 v80.96,86.36
  Bottom 0.254: v80.96,86.36 81.28,86.68 98.11,86.68 WR5.A
N$31
  Bottom 0.254: RN3.8 84.14,35.24 98.11,35.24 WR7.A
N$32
  Top 0.254: RN3.9 85.41,31.43 85.41,12.7 87,11.11 99.06,11.11 WR8.A
N$33  (via drill 0.25)
  Top 0.254: RN5.2 134.94,52.39 v134.94,85.72
  Bottom 0.254: v134.94,85.72 134.3,86.36 125.73,86.36 WR9.A
N$34  (via drill 0.25)
  Top 0.254: v129.54,45.4 124.46,40.32 WR11.A
  Bottom 0.254: RN5.4 133.03,45.4 v129.54,45.4
N$35  (via drill 0.25)
  Top 0.254: v148.27,43.5 151.13,46.35 151.13,86.36 WR13.A
  Bottom 0.254: RN5.6 136.21,43.5 v148.27,43.5
N$36
  Bottom 0.254: RN5.8 133.67,35.24 148.91,35.24 WR15.A
N$37  (via drill 0.25)
  Top 0.254: v3.49,36.83 0.64,39.69 0.64,105.73 8.26,113.35 11.43,113.35 IC1.6
  Bottom 0.254: IC3.5 17.78,36.83 v3.49,36.83
N$38  (via drill 0.25)
  Top 0.254: RN5.9 134.94,31.43 v134.94,8.57
  Bottom 0.254: v134.94,8.57 148.91,8.57 WR16.A
N$39
  Bottom 0.254: RN5.7 136.21,40.96 148.27,40.96 153.67,46.35 153.67,60.96 151.13,60.96 WR14.A
N$40
  Top 0.254: RN5.5 130.81,40.64 130.81,13.97 WR12.A
N$41  (via drill 0.25)
  Top 0.254: v129.54,49.21 127.64,51.12 127.64,57.78 WR10.A
  Bottom 0.254: RN5.3 132.4,49.21 v129.54,49.21
N$46  (via drill 0.25)
  Top 0.254: v23.81,21.27 25.08,20 25.08,11.75 IC4.11
  Bottom 0.254: SW1.7 16.83,9.21 25.72,9.21 IC4.11 | RN1.3 15.56,21.27 v23.81,21.27
N$64
  Top 0.254: SW1.6 16.83,6.67 16.83,17.46 RN1.4
  Bottom 0.254: IC4.14 25.4,19.05 RN1.4
N$73
  Top 0.254: SW1.5 13.65,4.13 13.65,14.92 RN1.5
  Bottom 0.254: IC4.1 18.73,22.54 13.97,22.54 10.48,19.05 7.3,19.05 6.35,18.1 6.35,16.51 RN1.5
N$82  (via drill 0.25)
  Top 0.254: v14.29,41.27 v14.29,65.41 14.29,98.74 IC1.8
  Bottom 0.254: IC3.4 18.41,41.27 v14.29,41.27 | v14.29,65.41 14.92,66.04 IC2.4
RD0  (via drill 0.25)
  Top 0.254: v56.2,72.71 58.74,75.25 58.74,104.46 61.28,107 | IC8.1 61.28,107 | RD1.K 74.61,101.92 74.61,106.05 73.66,107 61.28,107
  Bottom 0.254: IC2.15 27.62,70.17 35.88,70.17 38.42,72.71 v56.2,72.71
RD1  (via drill 0.25)
  Top 0.254: IC2.14 28.89,70.8 v28.89,80.33 | v63.82,72.71 63.82,79.69 IC9.1
  Bottom 0.254: v28.89,80.33 58.42,80.33 59.37,81.28 IC9.1 | RD2.K 74.93,72.39 71.75,72.39 71.44,72.71 v63.82,72.71
RD2  (via drill 0.25)
  Top 0.254: IC2.13 28.89,63.82 v28.89,56.2 | v67.63,51.12 66.99,51.75 v66.99,54.29
  Bottom 0.254: v28.89,56.2 30.48,54.61 IC10.1 66.67,54.61 v66.99,54.29 | RD3.K 72.07,51.12 v67.63,51.12
RD3  (via drill 0.25)
  Top 0.254: v71.12,28.89 72.39,27.62 72.39,19.68 73.03,19.05 76.2,19.05 RD4.K | IC2.12 28.26,61.91 28.26,57.78 27.3,56.83 23.18,56.83 v23.18,34.29
  Bottom 0.254: v71.12,28.89 63.18,28.89 IC11.1 33.34,27.94 29.84,31.43 26.04,31.43 v23.18,34.29
RD4  (via drill 0.25)
  Top 0.254: IC2.11 25.08,62.55 25.08,77.47 v38.73,91.12 | IC12.1 v93.66,101.92
  Bottom 0.254: v38.73,91.12 46.67,99.06 79.06,99.06 81.92,101.92 83.82,101.92 85.41,103.5 85.41,107.95 IC12.1 | RD5.K 100.01,101.92 v93.66,101.92
RD5  (via drill 0.25)
  Top 0.254: v56.2,60.01 59.37,63.18 v59.37,80.33 | v86.36,70.17 86.04,70.48 86.04,79.69 IC13.1
  Bottom 0.254: IC2.10 26.99,58.74 31.11,58.74 31.75,59.37 40.64,59.37 41.27,60.01 v56.2,60.01 | v59.37,80.33 86.68,80.33 IC13.1 | RD6.K 98.11,70.17 v86.36,70.17
RD6  (via drill 0.25)
  Top 0.254: v86.36,46.04 86.04,46.35 86.04,53.02 IC14.1
  Bottom 0.254: IC2.9 28.89,53.66 86.68,53.66 IC14.1 | RD7.K 100.33,45.72 97.79,45.72 97.47,46.04 v86.36,46.04
RD7  (via drill 0.25)
  Top 0.254: v23.81,56.2 25.08,54.93 25.08,34.92 26.04,33.97 30.16,33.97 30.16,7.3 33.97,3.49 100.33,3.49 100.33,19.05 RD8.K 97.47,24.45 97.47,26.35 94.61,26.35 v93.34,27.62
  Bottom 0.254: IC2.7 21.27,56.2 v23.81,56.2 | IC15.1 87.95,27.62 v93.34,27.62
RD8  (via drill 0.25)
  Top 0.254: IC3.15 29.53,48.58 v29.53,80.96 | RD9.K 125.41,101.92 125.41,106.05 124.46,107 113.03,107 IC16.1
  Bottom 0.254: v29.53,80.96 34.29,85.72 58.1,85.72 61.59,89.22 64.14,89.22 69.22,94.3 76.83,94.3 81.92,99.38 83.82,99.38 86.04,101.6 86.04,104.46 109.54,104.46 IC16.1
RD9  (via drill 0.25)
  Top 0.254: IC3.14 30.16,46.67 30.16,58.42 31.43,59.69 31.43,66.67 32.38,67.63 34.92,67.63 v34.92,68.26 | IC17.1 109.54,77.79 v109.54,74.93
  Bottom 0.254: v34.92,68.26 38.73,72.07 71.12,72.07 71.44,71.75 85.09,71.75 86.04,72.71 96.52,72.71 97.79,73.98 97.79,74.93 v109.54,74.93 112.08,72.39 125.73,72.39 RD10.K
RD10  (via drill 0.25)
  Top 0.254: v126.05,53.66 127,52.7 RD11.K
  Bottom 0.254: IC3.13 28.26,42.23 59.69,42.23 60.96,40.96 107.31,40.96 112.08,45.72 125.73,45.72 RD11.K | IC18.1 113.98,53.66 v126.05,53.66
RD11  (via drill 0.25)
  Top 0.254: v110.49,38.42 111.44,37.47 111.44,29.53 | IC19.1 111.44,29.53 | v111.76,21.91 111.44,22.23 111.44,29.53
  Bottom 0.254: IC3.12 30.16,41.59 57.78,41.59 60.96,38.42 v110.49,38.42 | RD12.K 125.41,21.91 v111.76,21.91
RD12  (via drill 0.25)
  Top 0.254: IC3.11 30.16,39.05 v30.16,44.77 | v41.91,44.77 55.56,58.42 55.56,103.5 60.96,108.9 138.43,108.9 IC20.1
  Bottom 0.254: v41.91,44.77 v30.16,44.77 | RD13.K 152.4,107 139.38,107 IC20.1
RD13  (via drill 0.25)
  Top 0.254: v41.91,32.07 60.01,50.16 v60.01,76.2
  Bottom 0.254: IC3.10 27.62,32.07 v41.91,32.07 | v60.01,76.2 61.59,77.79 92.08,77.79 94.61,80.33 137.48,80.33 IC21.1 141.92,77.79 147,77.79 RD14.K
RD14
  Top 0.254: IC3.9 29.53,27.62 29.53,6.99 33.66,2.86 148.59,2.86 148.59,42.86 152.4,46.67 RD15.K
  Bottom 0.254: IC22.1 139.38,53.66 149.86,53.66 152.4,51.12 RD15.K
RD15
  Bottom 0.254: IC3.7 19.37,32.7 21.59,32.7 27.3,26.99 137.48,26.99 | IC23.1 137.48,26.99 | RD16.K 152.4,26.99 137.48,26.99
VCC
  Top 0.254: X1.A2 X1.B2 8.89,20.32 | 8.89,20.32 X1.C2 | SW1.4 SW1.3 SW1.2 SW1.1 8.89,11.43 8.89,20.32 | X1.B31 X1.A31 | V1.14 29.21,99.06 29.21,104.14 | C5.1 29.21,104.14 | 29.21,104.14 IC1.14 | C6.1 C7.1 | C1.1 C2.1 C3.1 C4.1 | C13.1 96.84,107.95 | 96.84,107.95 IC12.20 | IC8.20 C9.1 RN2.1 | C21.1 IC20.20 | IC16.20 C17.1 RN4.1 | C14.1 97.16,81.28 | 97.16,81.28 96.84,81.28 | 96.84,81.28 IC13.20 | 96.84,81.28 96.84,107.95 | C15.1 97.47,56.2 97.47,72.39 97.16,72.71 97.16,81.28 | IC15.20 93.66,29.53 93.66,53.02 IC14.20
  Bottom 0.254: IC7.14 40.32,23.18 37.78,23.18 36.83,24.13 | C8.1 36.83,24.13 | 36.83,24.13 34.61,21.91 27.62,21.91 IC4.16 25.08,24.45 22.54,24.45 C4.1 21.27,25.08 13.97,25.08 9.21,20.32 X1.B2 | C1.1 21.59,102.55 22.54,102.55 IC1.14 | X1.B31 X1.C31 11.75,95.57 25.72,95.57 V1.14 | IC3.16 26.99,48.58 31.11,48.58 32.38,49.85 | 32.38,49.85 33.34,50.8 C7.1 | IC6.16 39.05,49.85 32.38,49.85 | IC5.16 39.05,75.25 36.51,75.25 C6.1 29.21,76.2 IC2.16 24.13,73.66 C2.1 | R1.2 167.64,27.94 C24.1 IC23.20 145.1,28.89 125.41,28.89 C20.1 IC19.20 119.7,28.89 100.01,28.89 C16.1 IC15.20 94.3,28.89 74.61,28.89 C12.1 IC11.20 | IC10.20 C11.1 RN3.1 83.82,54.61 84.77,55.56 94.3,55.56 IC14.20 C15.1 100.01,55.56 119.7,55.56 IC18.20 C19.1 132.08,54.61 RN5.1 135.57,55.56 145.1,55.56 IC22.20 C23.1 | IC12.20 94.3,108.9 83.5,108.9 RN2.1 | IC20.20 145.1,108.9 134.3,108.9 RN4.1 | C13.1 100.01,108.9 119.7,108.9 IC16.20 | C22.1 147.32,80.01 IC21.20 145.1,82.23 125.41,82.23 C18.1 IC17.20 119.7,82.23 100.01,82.23 C14.1 | IC9.20 C10.1 74.61,82.23 94.3,82.23 IC13.20 | C5.1 30.16,108.9 68.9,108.9 IC8.20
WR0  (via drill 0.25)
  Top 0.254: IC5.15 43.81,74.3 v43.81,80.96
  Bottom 0.254: v43.81,80.96 46.99,84.14 59.05,84.14 | 59.05,84.14 68.9,84.14 IC8.11 | WR1.K 74.93,88.9 65.72,88.9 62.87,86.04 60.96,86.04 59.05,84.14
WR1  (via drill 0.25)
  Top 0.254: IC5.14 43.81,65.41 v43.81,57.47 | WR2.K 74.3,59.05 v74.3,57.78
  Bottom 0.254: v43.81,57.47 68.9,57.47 69.22,57.78 | IC9.11 69.22,57.78 | 69.22,57.78 v74.3,57.78
WR2  (via drill 0.25)
  Top 0.254: IC10.11 76.2,31.75 WR3.K | v63.82,65.09 65.72,63.18 v65.72,32.7
  Bottom 0.254: IC5.13 41.59,65.09 v63.82,65.09 | v65.72,32.7 66.67,31.75 IC10.11
WR3  (via drill 0.25)
  Top 0.254: WR4.K 76.2,5.08 IC11.11 65.09,9.84 65.09,61.28 v64.45,61.91
  Bottom 0.254: IC5.12 60.01,63.5 61.59,61.91 v64.45,61.91
WR4  (via drill 0.25)
  Top 0.254: v103.5,63.82 103.5,85.72 102.55,86.68 | WR5.K 102.55,86.68 | 102.55,86.68 v101.28,85.41
  Bottom 0.254: IC5.11 40.96,60.64 60.33,60.64 60.96,60.01 72.71,60.01 73.03,59.69 84.14,59.69 86.36,61.91 98.11,61.91 100.01,63.82 v103.5,63.82 | IC12.11 95.57,85.41 v101.28,85.41
WR5
  Bottom 0.254: IC5.10 41.59,59.37 72.39,59.37 73.34,58.42 85.41,58.42 86.36,59.37 94.3,59.37 IC13.11 99.06,58.42 WR6.K
WR6  (via drill 0.25)
  Top 0.254: v103.5,56.2 103.5,46.35 100.33,43.18 100.33,35.56 101.28,34.61 | 101.28,34.61 v98.42,31.75 | 101.28,34.61 WR7.K
  Bottom 0.254: IC5.9 84.14,55.88 84.45,56.2 v103.5,56.2 | v98.42,31.75 IC14.11
WR7
  Top 0.254: IC5.7 30.8,56.2 30.8,7.62 34.29,4.13 95.25,4.13 IC15.11
  Bottom 0.254: WR8.K 99.06,5.08 IC15.11
WR8  (via drill 0.25)
  Top 0.254: IC6.15 54.93,60.01 v54.93,80.96 | v123.83,84.45 WR9.K
  Bottom 0.254: v54.93,80.96 57.47,83.5 119.06,83.5 120.02,84.45 | IC16.11 120.02,84.45 | 120.02,84.45 v123.83,84.45
WR9  (via drill 0.25)
  Top 0.254: v100.97,42.86 110.81,52.7 v110.81,58.42
  Bottom 0.254: IC6.14 40.96,42.86 v100.97,42.86 | v110.81,58.42 111.76,59.37 119.7,59.37 IC17.11 124.46,58.42 WR10.K
WR10
  Bottom 0.254: IC6.13 39.05,39.05 39.05,33.97 60.33,33.97 60.96,33.34 72.71,33.34 73.34,32.7 97.79,32.7 98.11,32.38 111.44,32.38 111.76,32.7 119.7,32.7 IC18.11 124.46,31.75 WR11.K
WR11  (via drill 0.25)
  Top 0.254: v100.97,37.78 109.22,29.53 109.22,9.21 112.39,6.03 120.65,6.03 IC19.11
  Bottom 0.254: IC6.12 40.96,37.78 v100.97,37.78 | WR12.K 124.46,5.08 IC19.11
WR12  (via drill 0.25)
  Top 0.254: v149.22,35.88 153.67,40.32 153.67,86.36 WR13.K
  Bottom 0.254: IC6.11 79.06,35.56 81.28,33.34 98.11,33.34 98.42,33.02 111.12,33.02 111.44,33.34 117.47,33.34 120.02,35.88 131.44,35.88 132.08,36.51 136.53,36.51 137.16,35.88 v149.22,35.88 | IC20.11 147.32,86.36 151.13,86.36 WR13.K
WR13  (via drill 0.25)
  Top 0.254: IC6.10 59.37,51.75 v59.37,56.52
  Bottom 0.254: v59.37,56.52 59.69,56.83 124.46,56.83 125.09,56.2 143.83,56.2 IC21.11 151.13,58.42 WR14.K
WR14
  Bottom 0.254: IC6.9 40.96,30.16 144.46,30.16 IC22.11 149.86,31.75 WR15.K
WR15  (via drill 0.25)
  Top 0.254: IC6.7 31.43,31.43 v31.43,26.35
  Bottom 0.254: v31.43,26.35 48.9,26.35 60.96,14.29 142.24,14.29 145.41,11.11 148.91,11.11 152.08,7.94 | IC23.11 147.32,6.35 150.5,6.35 152.08,7.94 | 152.08,7.94 WR16.K

### Text on the board
tNames: YACC1 MEM-REGISTER V1.0 | 0000 | 0100 | 1000 | 1100 | 0001 | 0101 | 1001 | 1101 | 0010 | 0110 | 1010 | 1110 | 0011 | 0111 | 1011 | 1111 | onepagecomputer.com